# EasyEDA Pro project ProProject_Stc32f_Car副本_2024-06-03.epro, schematic schematic6

## Sheets
1 Motor_Driver: Create Date: 2024-05-04; Page Name: Motor_Driver; Project Name: Stc32f_Car; Schematic Name: Schematic6; Update Date: 2024-05-11; Company: 嘉立创EDA; Page Size: A4; Version: V1.0
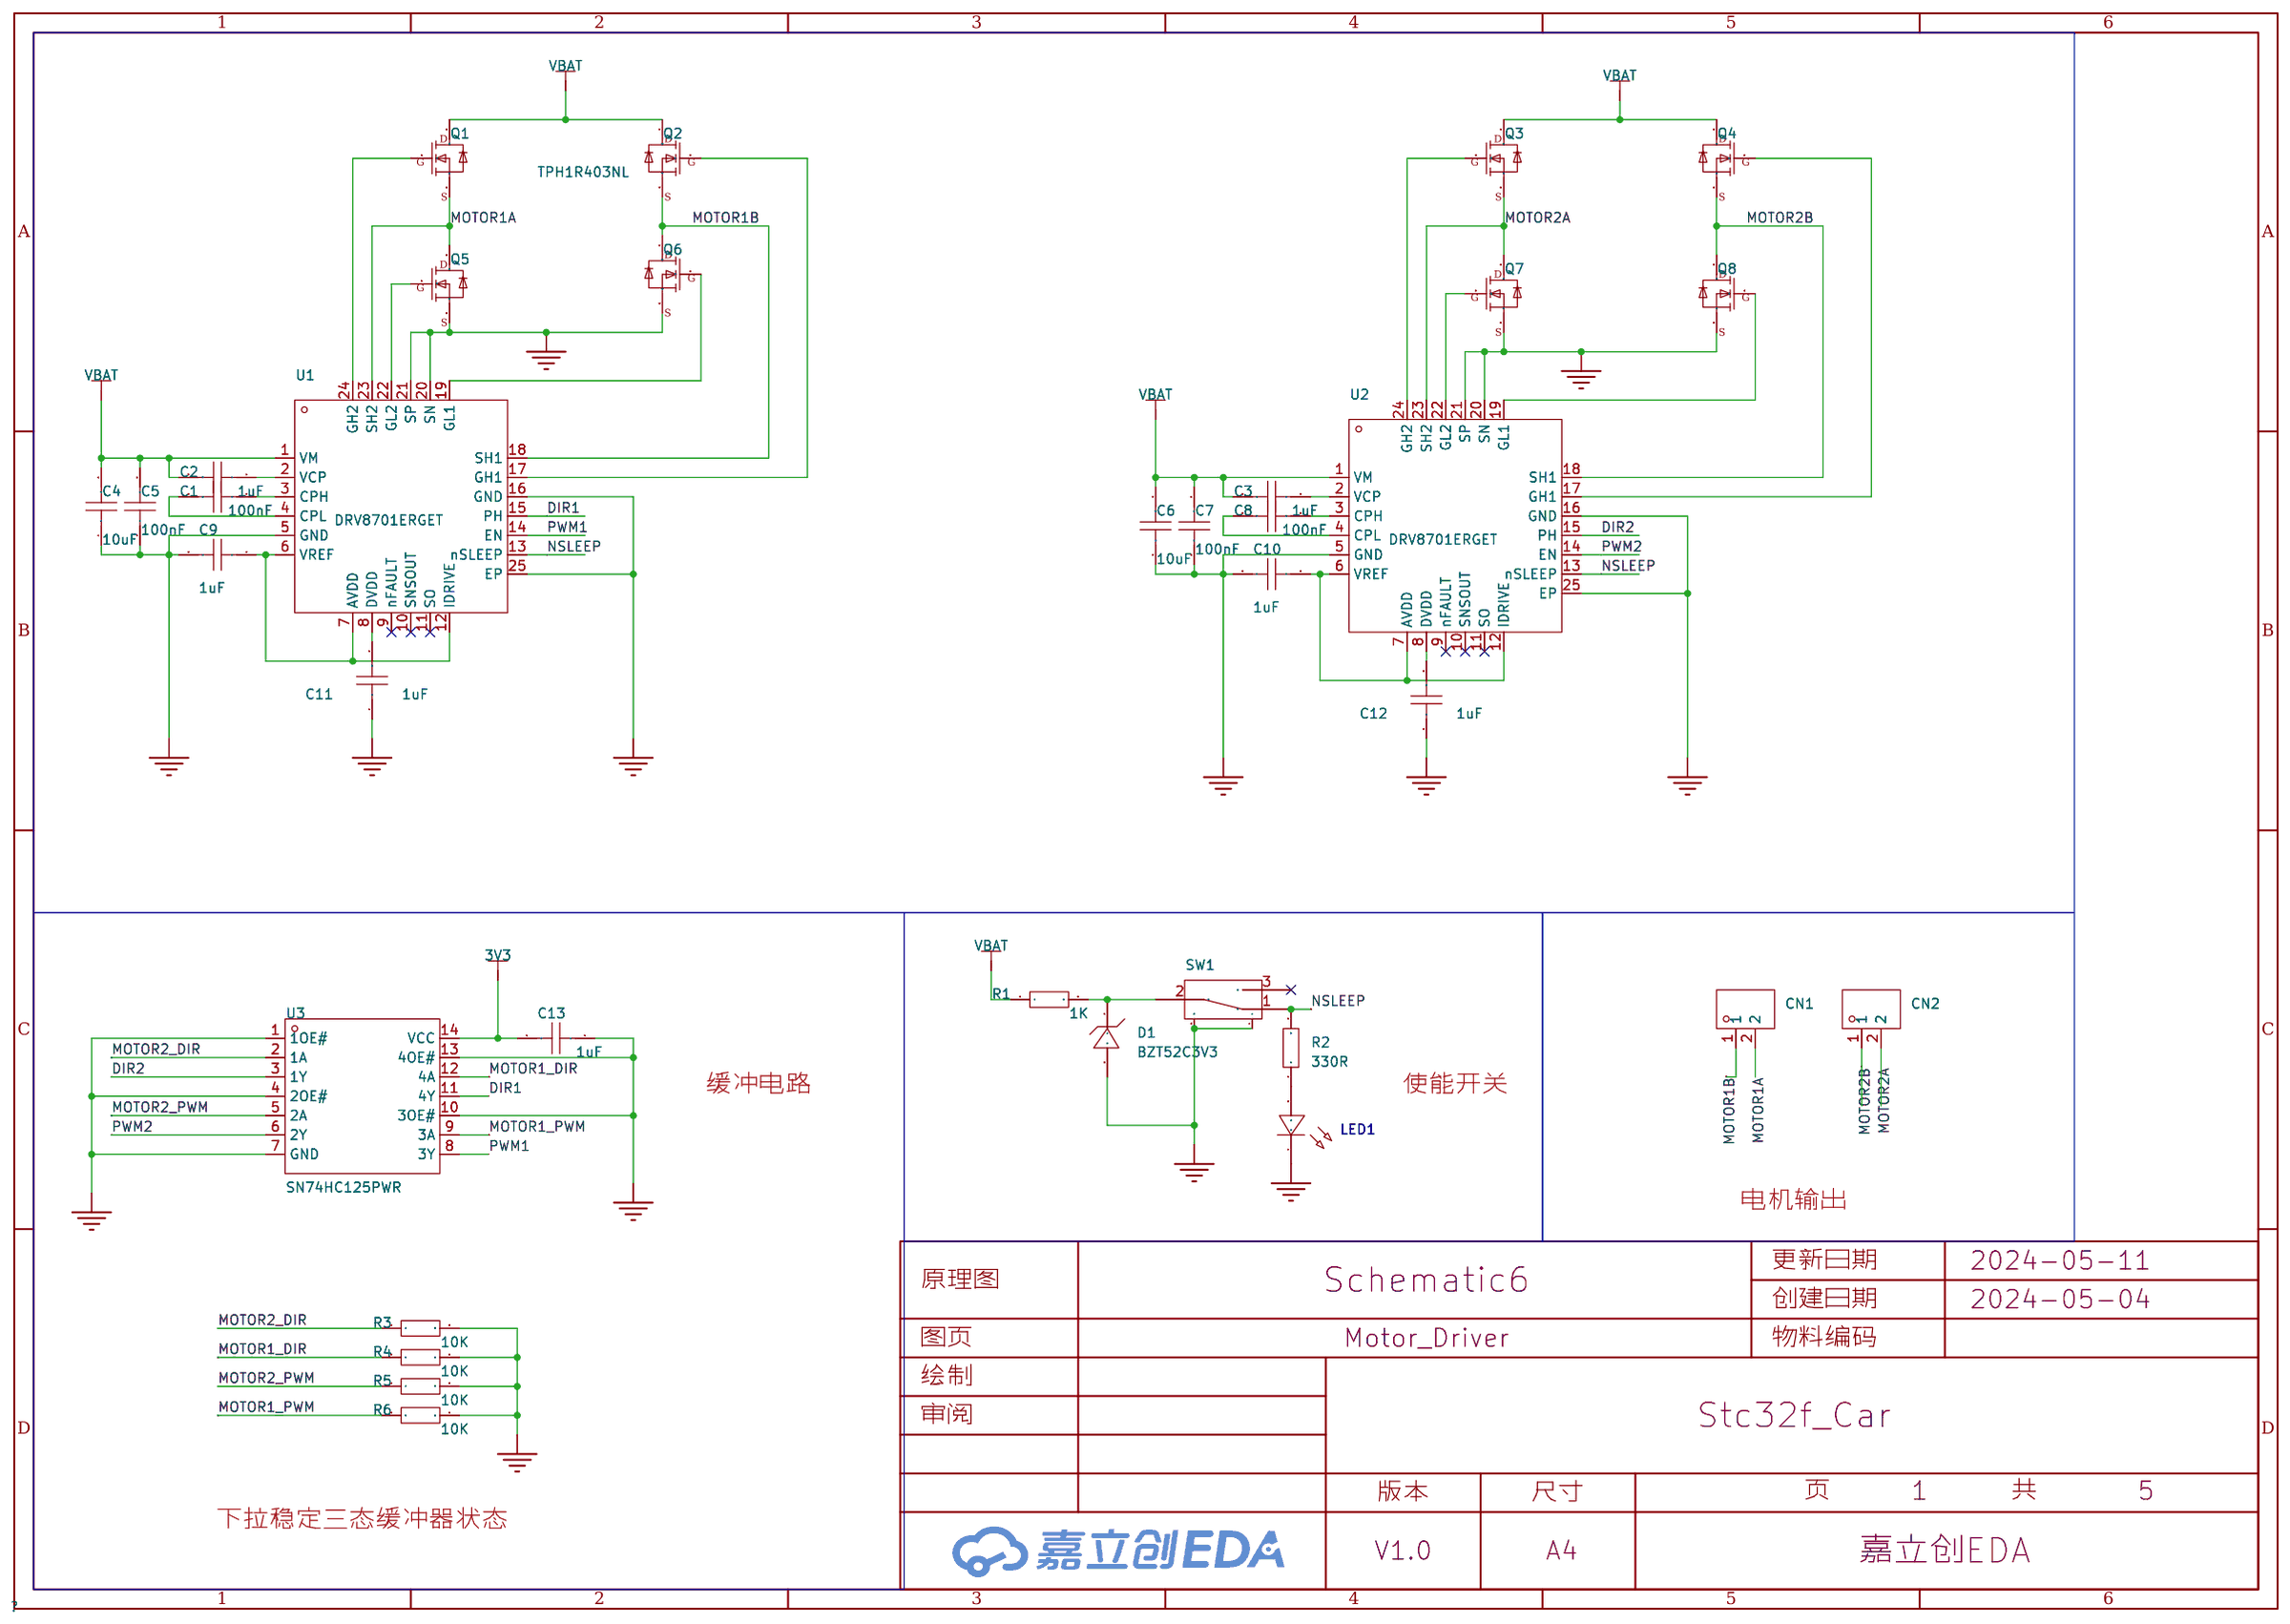
[diagram p4: Motor_Driver]
2 DCDC&amp;LDO: Page Name: DCDC&amp;LDO; Update Date: 2024-05-13
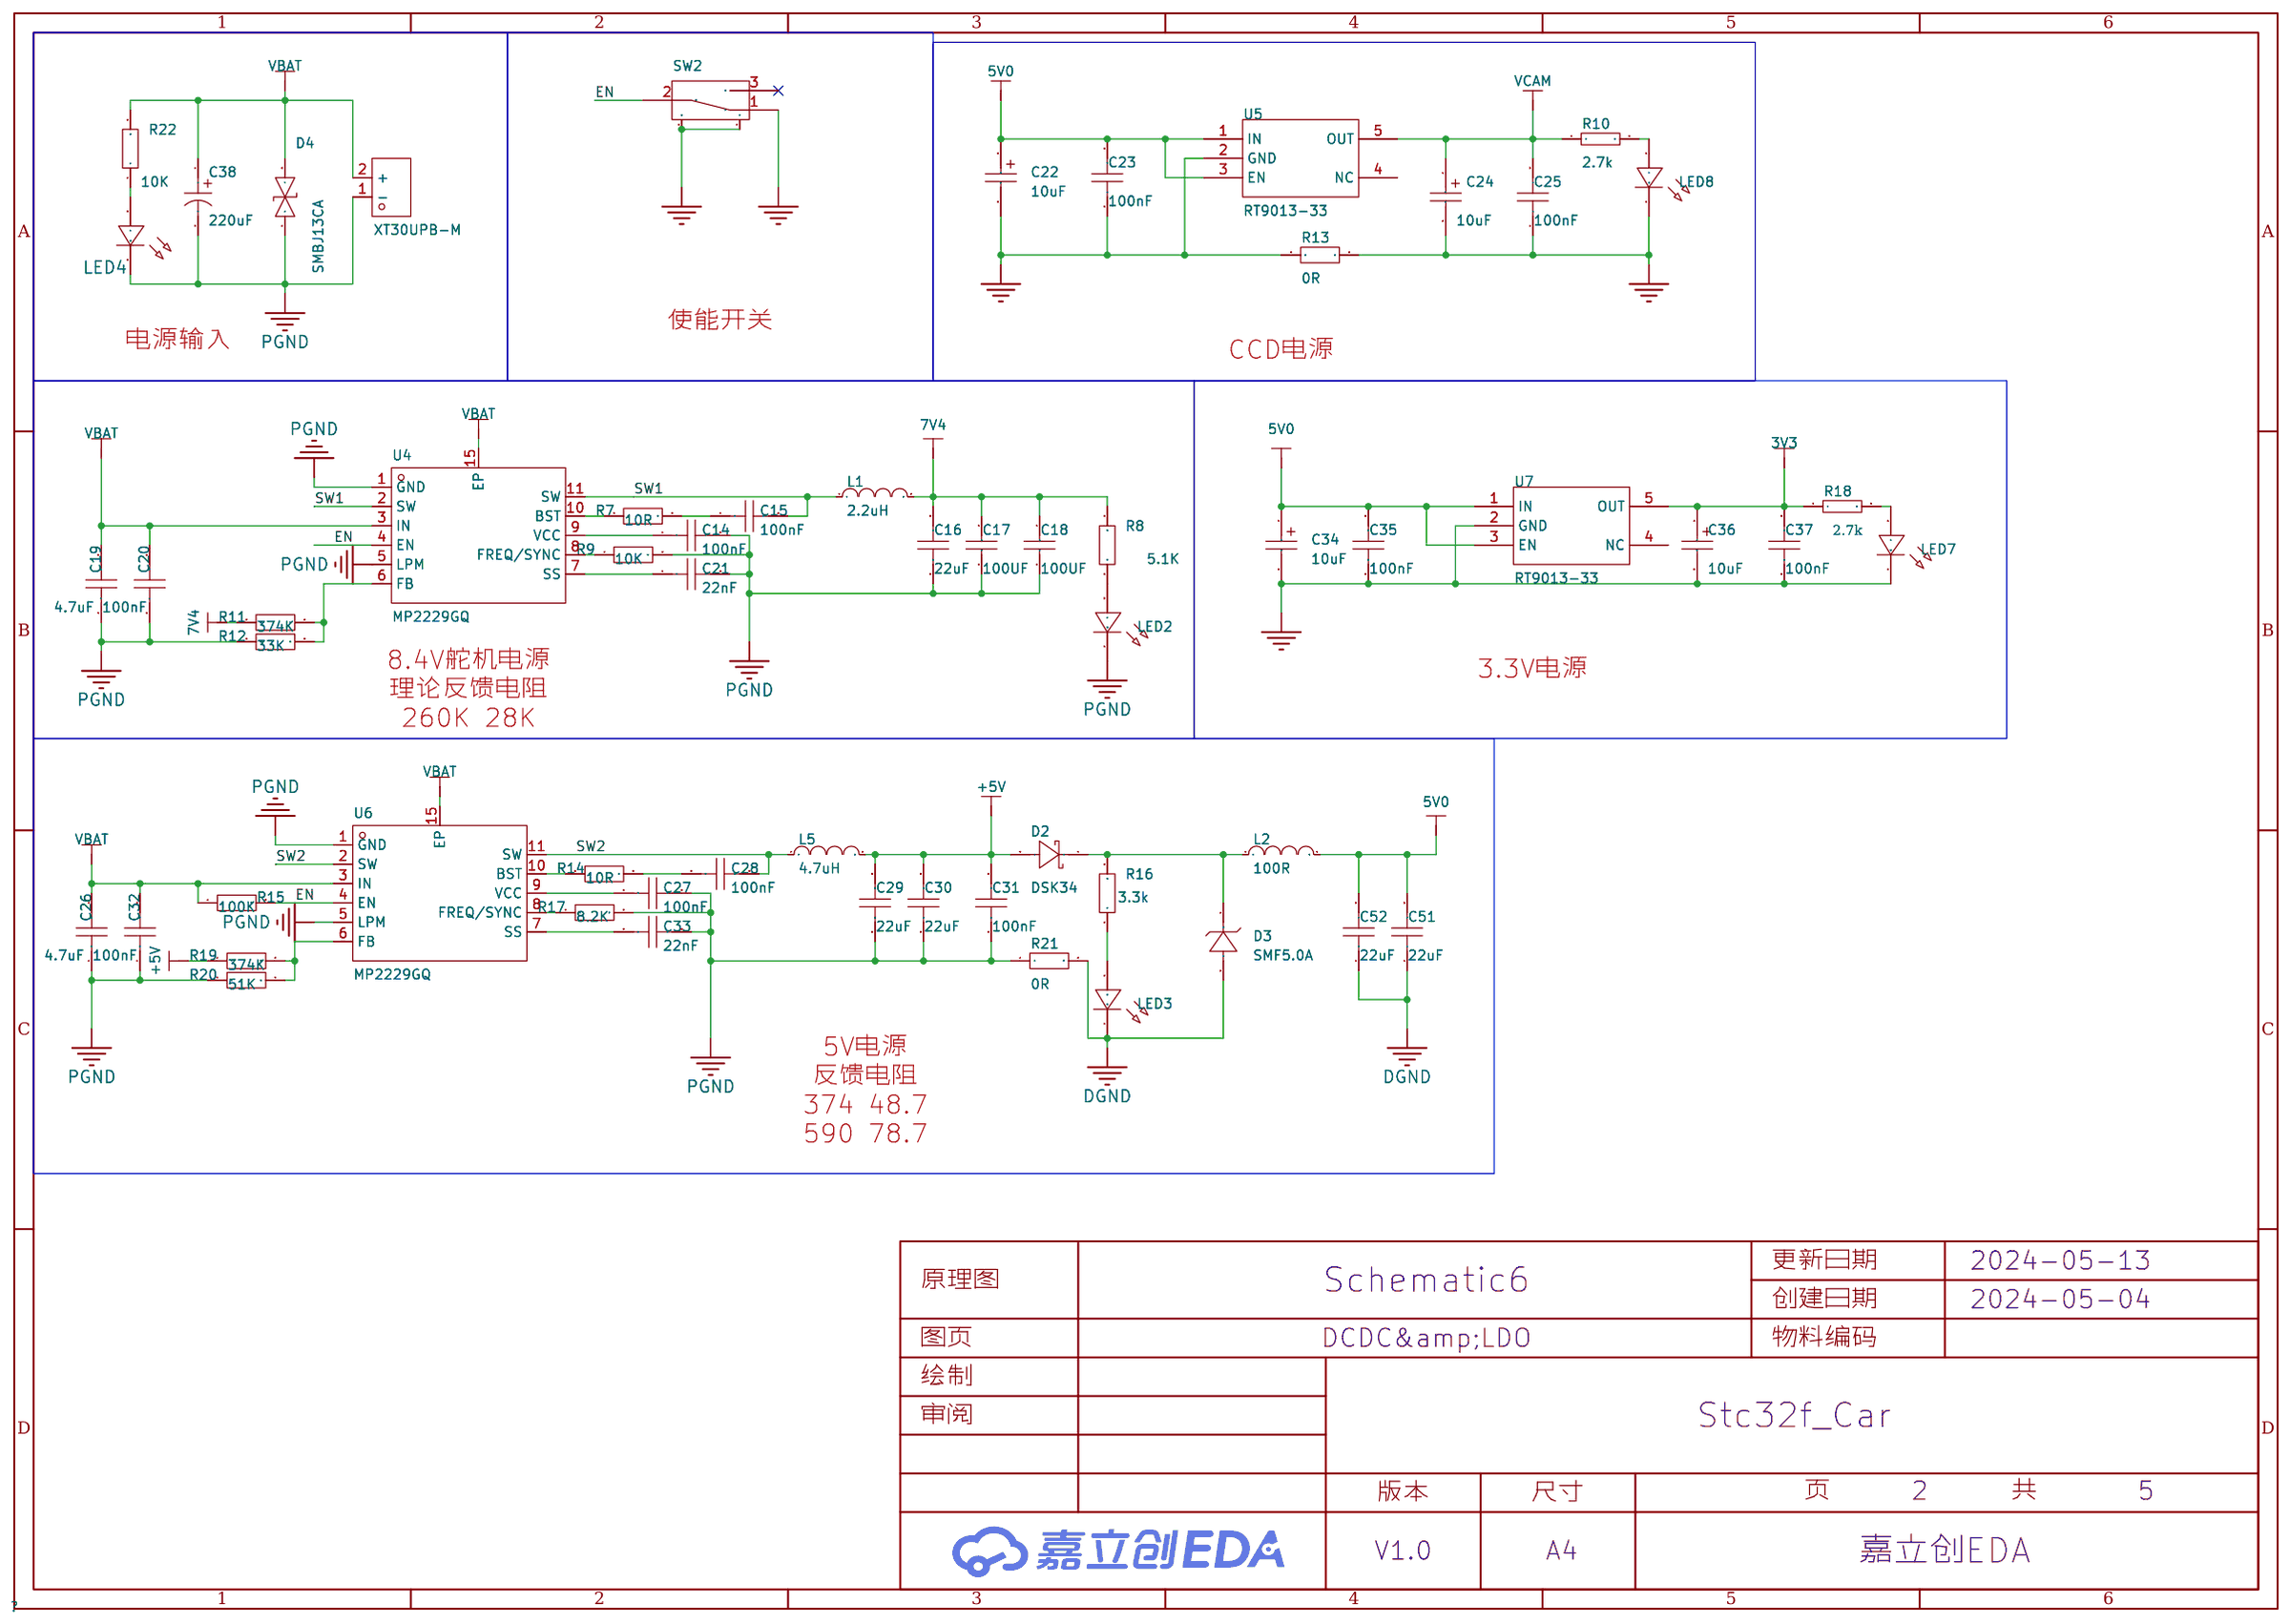
[diagram p5: DCDC&amp;LDO]
3 STC32F_Core: Page Name: STC32F_Core; Update Date: 2024-05-09
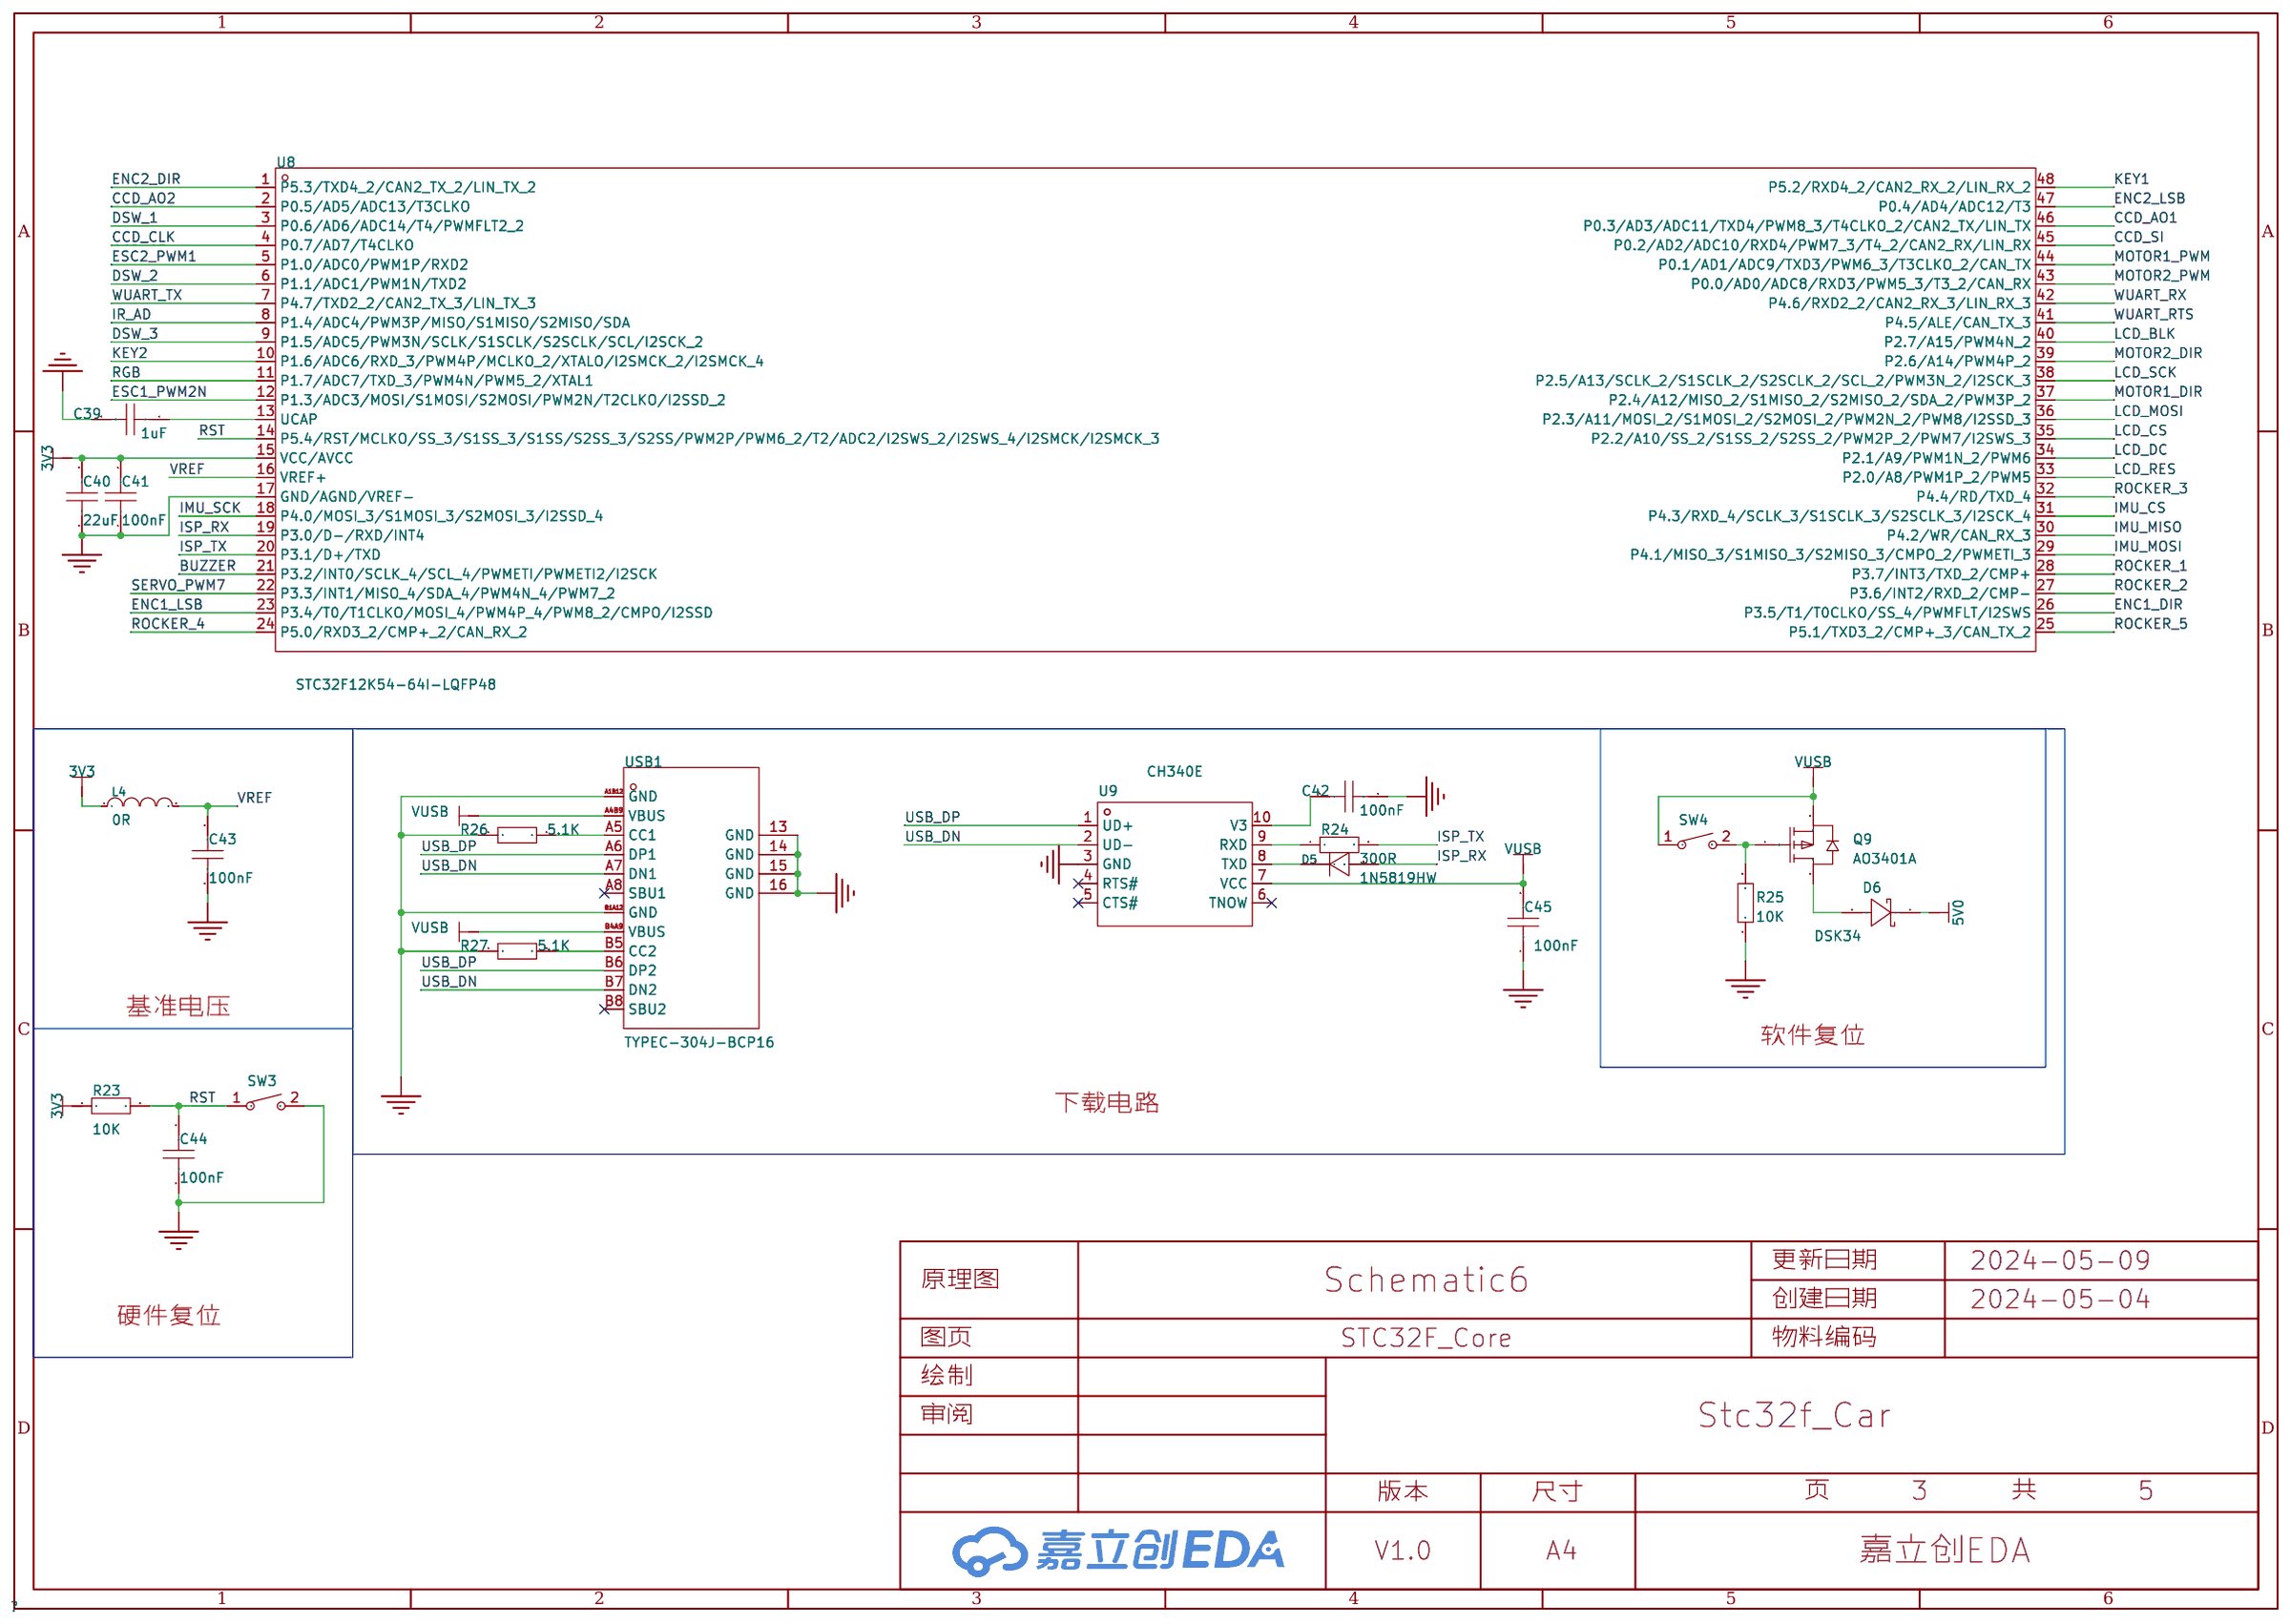
[diagram p6: STC32F_Core]
4 Conn_Port: Page Name: Conn_Port
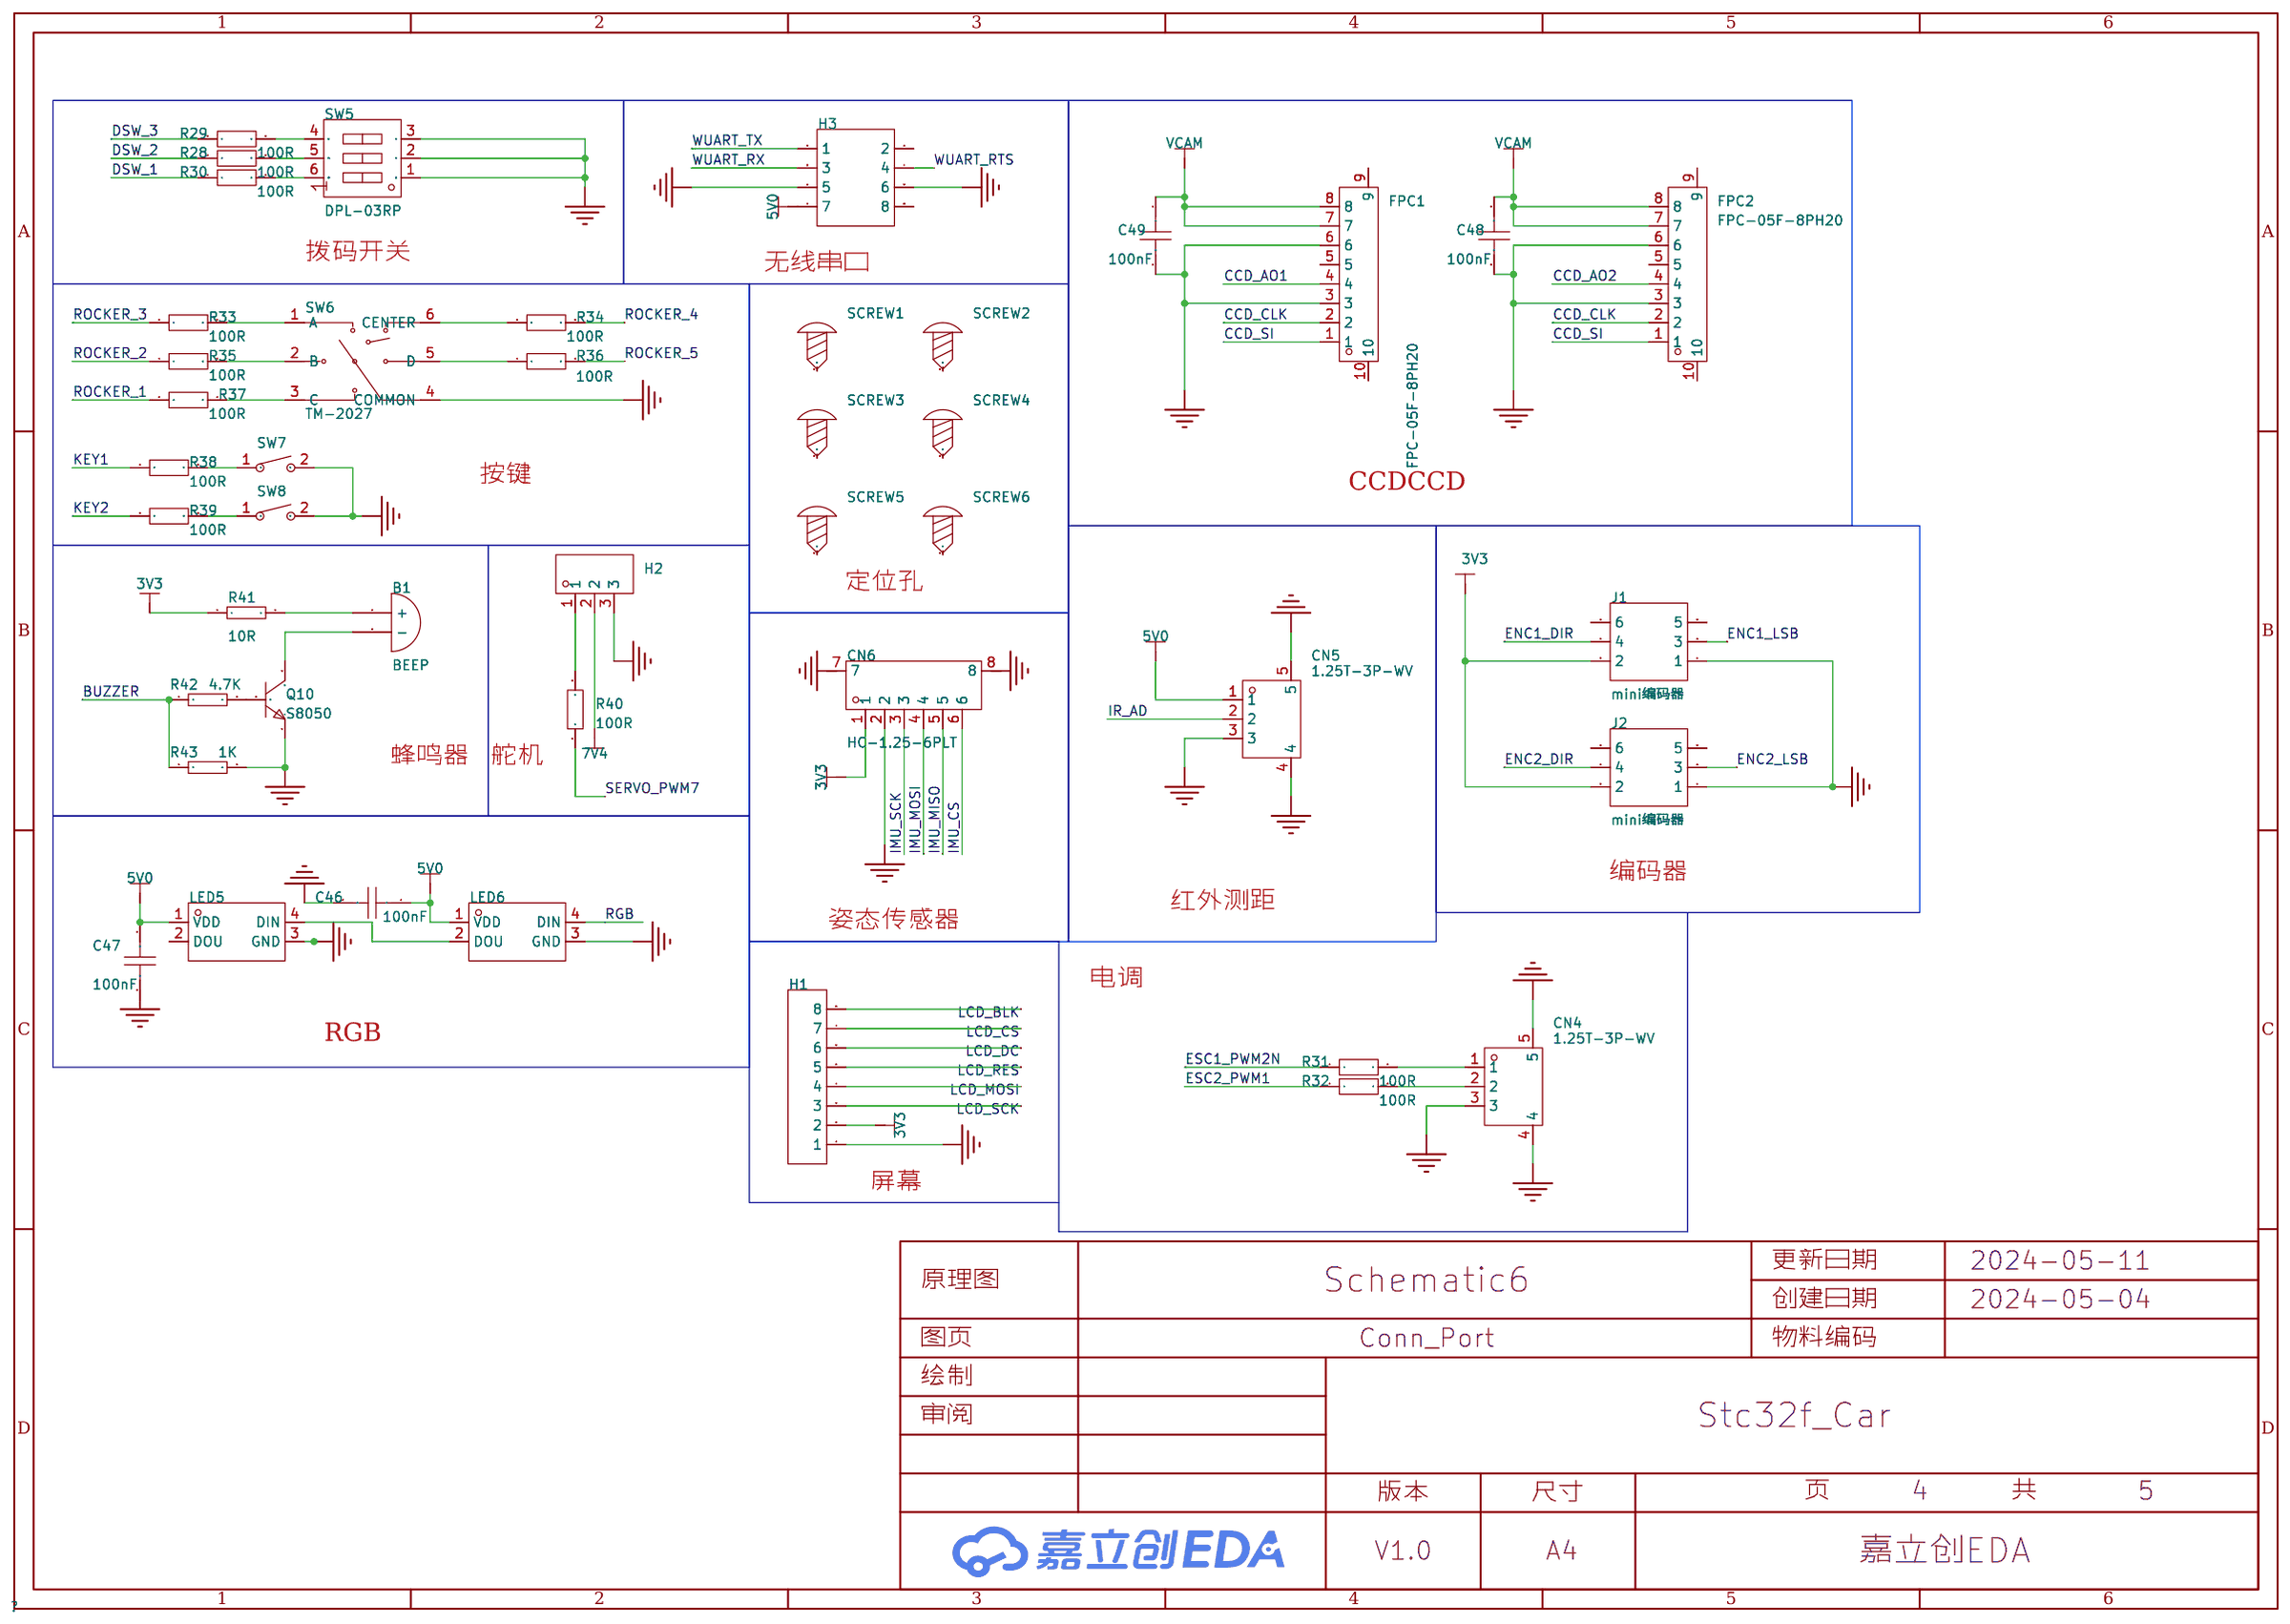
[diagram p7: Conn_Port]
5 引脚: Create Date: 2024-05-11; Page Name: 引脚
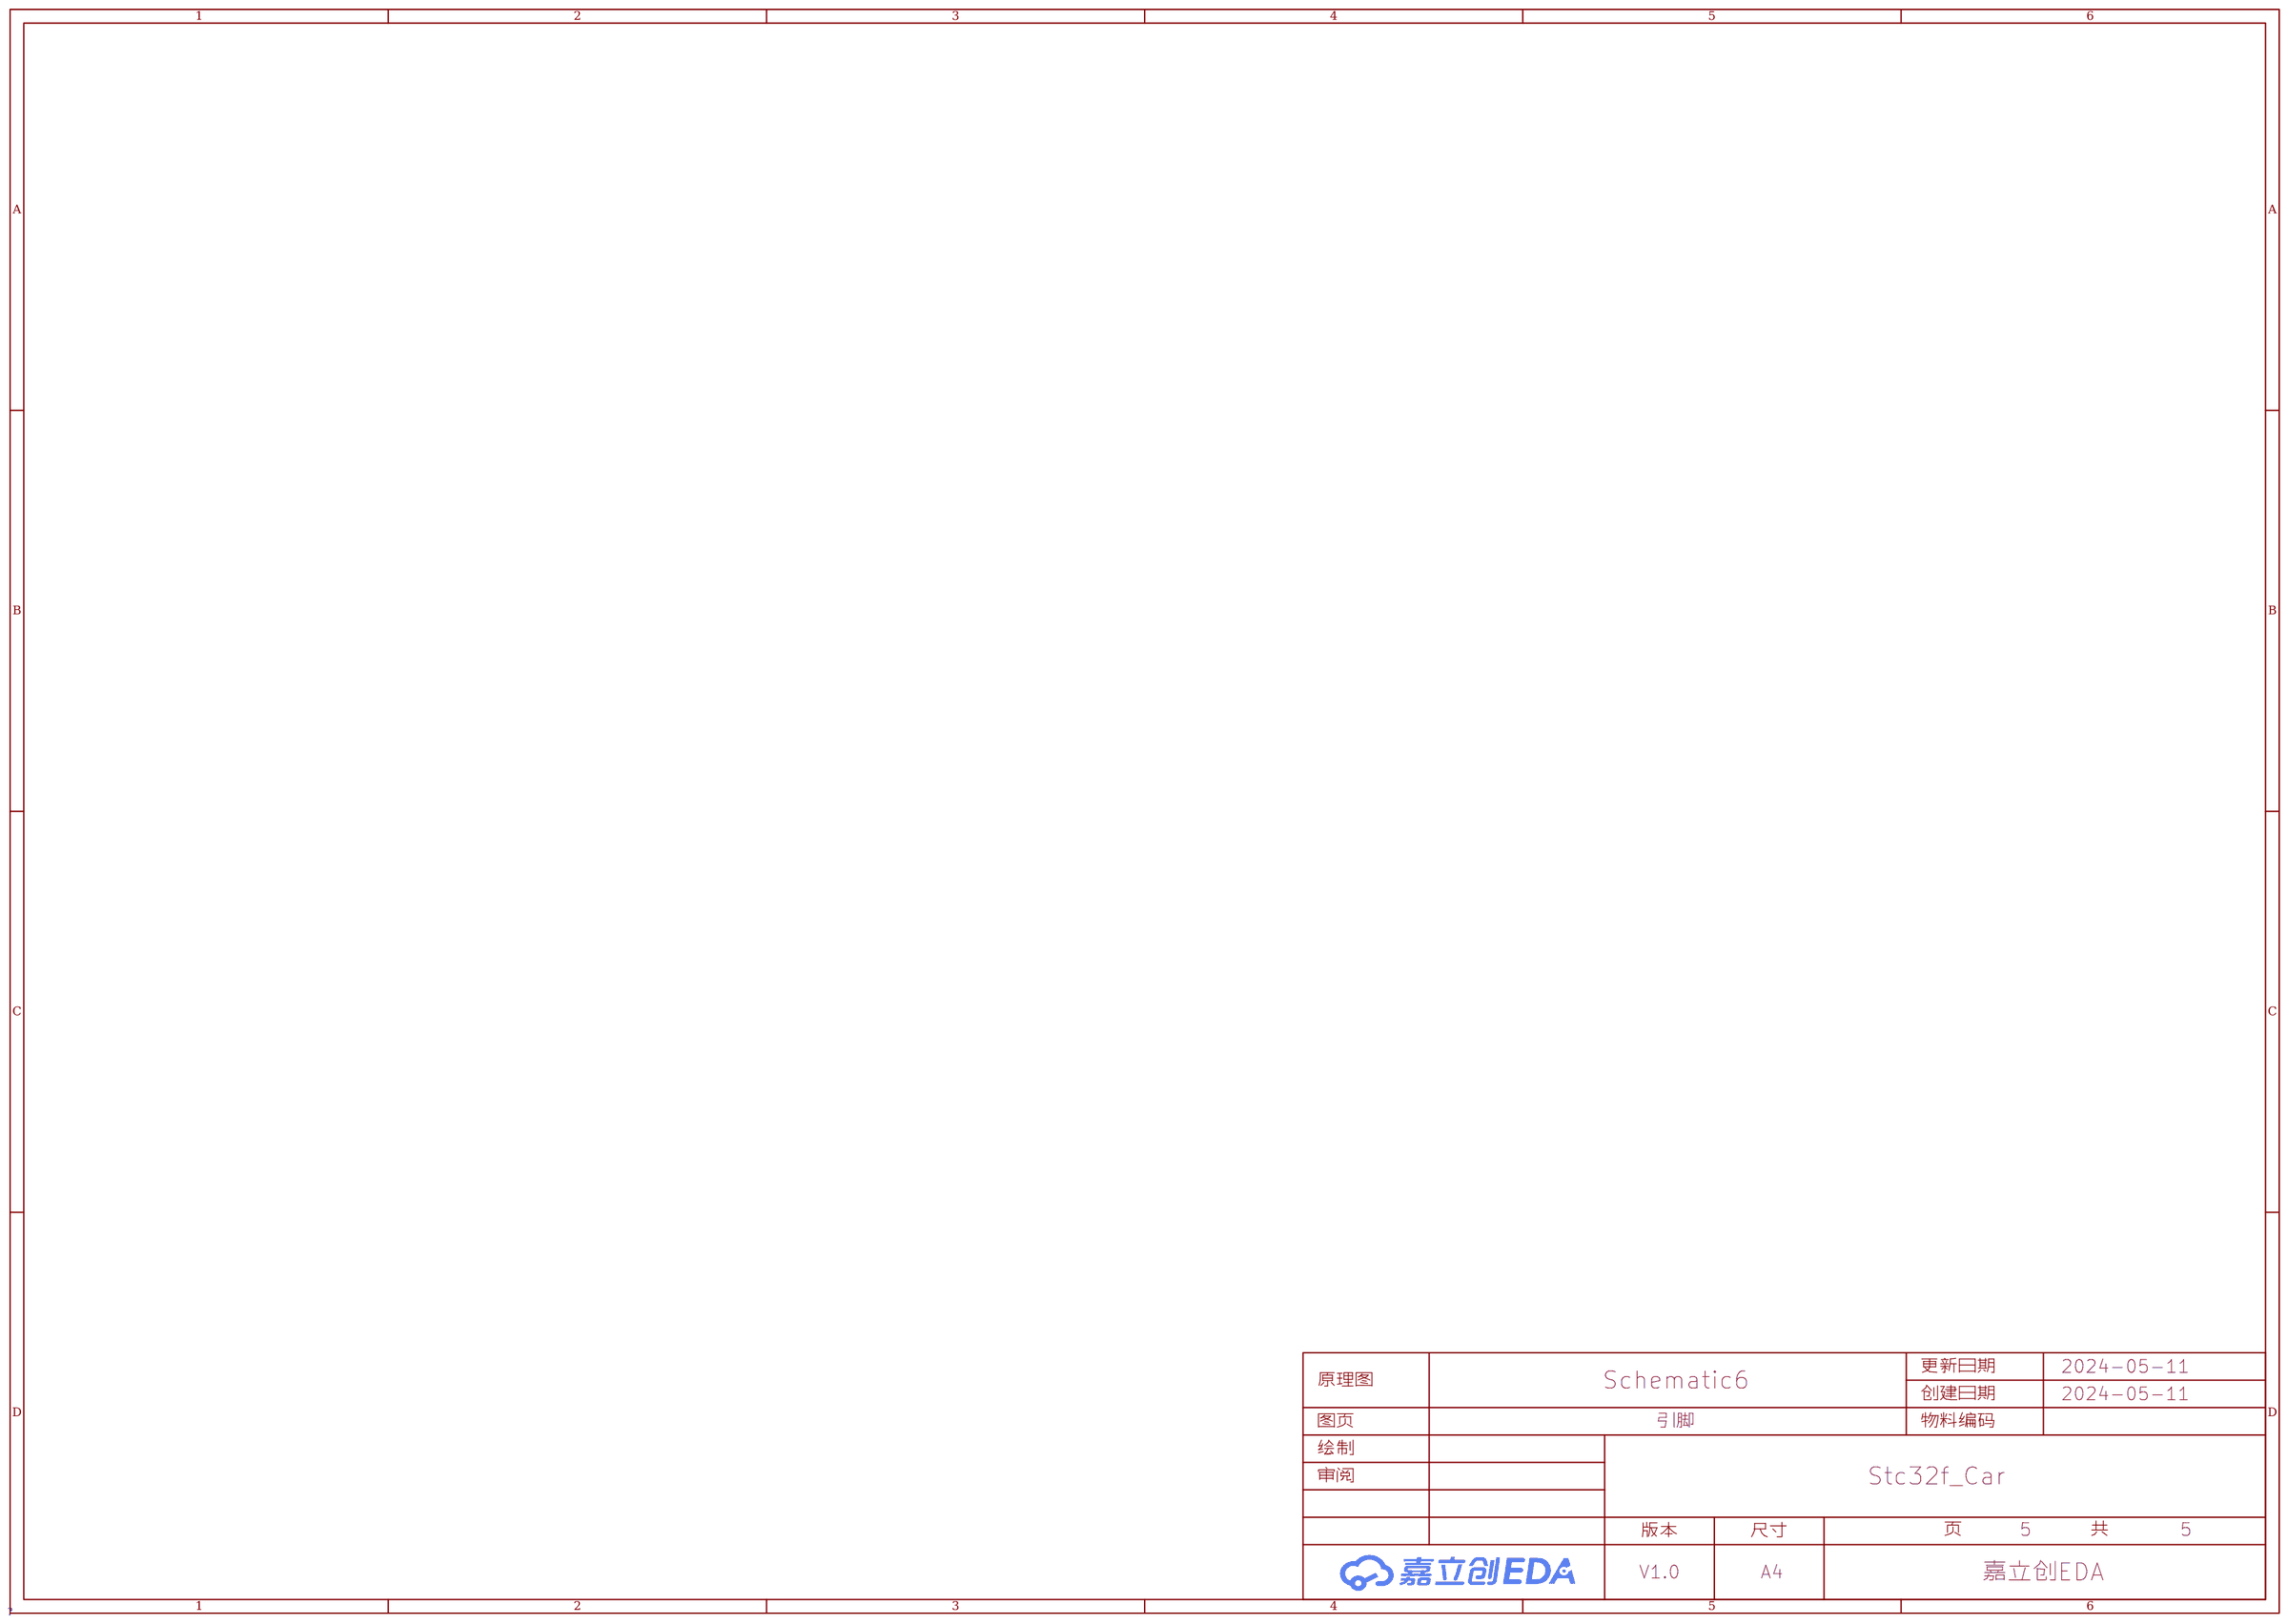
[diagram p8: 引脚]

## Parts
sheet Conn_Port
B1  BEEP  [BEEP 9x5.5mm]
C46  100nF  [C0603]
C47  100nF  [C0603]
C48  100nF  [C0603]
C49  100nF  [C0603]
CN4  1.25T-3P-WV  [CONN-SMD_1.25T-3P-WV]
CN5  1.25T-3P-WV  [CONN-SMD_1.25T-3P-WV]
CN6  HC-1.25-6PLT  [CONN-SMD_6P-P1.25_HC-1.25-6PLT]
FPC1  FPC-05F-8PH20  [FPC-SMD_8P-P0.50_FPC-05F-8PH20]
FPC2  FPC-05F-8PH20  [FPC-SMD_8P-P0.50_FPC-05F-8PH20]
H1  -  [HDR-TH_8P-P2.54-V-F-1]
H2  -  [HDR-TH_3P-P2.54-V-M]
H3  -  [HDR-TH_8P-P2.54-V-F-R2-C4-S2.54-1]
J1  mini编码器  [编码器牛角座_2x3_2.54]
J2  mini编码器  [编码器牛角座_2x3_2.54]
LED5  XL-5050RGBC-WS2812B  [LED-SMD_4P-L5.0-W5.0-BL_XL-5050RGBC]
LED6  XL-5050RGBC-WS2812B  [LED-SMD_4P-L5.0-W5.0-BL_XL-5050RGBC]
Q10  S8050  [SOT-23]
R28  100R  [R0603]
R29  100R  [R0603]
R30  100R  [R0603]
R31  100R  [R0603]
R32  100R  [R0603]
R33  100R  [R0603]
R34  100R  [R0603]
R35  100R  [R0603]
R36  100R  [R0603]
R37  100R  [R0603]
R38  100R  [R0603]
R39  100R  [R0603]
R40  100R  [R0603]
R41  10R  [R0603]
R42  4.7K  [R0603]
R43  1K  [R0603]
SCREW1  -  [M3螺丝]
SCREW2  -  [M3螺丝]
SCREW3  -  [M3螺丝]
SCREW4  -  [M3螺丝]
SCREW5  -  [M3螺丝]
SCREW6  -  [M3螺丝]
SW5  DPL-03RP  [SW-TH_6P-L9.2-W9.9-P2.54-LS7.6_1]
SW6  TM-2027  [SW-SMD_6P-P2.80-L10.2-W10.2]
SW7  TS-1071AD-A1B3-D4  [SW-SMD_L4.0-W3.0-LS4.8]
SW8  TS-1071AD-A1B3-D4  [SW-SMD_L4.0-W3.0-LS4.8]
sheet DCDC&amp;LDO
C14  100nF  [C0603]
C15  100nF  [C0603]
C16  22uF  [C0805]
C17  100UF  [CAP_1210]
C18  100UF  [CAP_1210]
C19  4.7uF  [CAP_1206]
C20  100nF  [C0603]
C21  22nF  [C0603]
C22  10uF  [CAP-T-S 3216]
C23  100nF  [C0603]
C24  10uF  [CAP-T-S 3216]
C25  100nF  [C0603]
C26  4.7uF  [CAP_1206]
C27  100nF  [C0603]
C28  100nF  [C0603]
C29  22uF  [C0805]
C30  22uF  [C0805]
C31  100nF  [C0603]
C32  100nF  [C0603]
C33  22nF  [C0603]
C34  10uF  [CAP-T-S 3216]
C35  100nF  [C0603]
C36  10uF  [CAP-T-S 3216]
C37  100nF  [C0603]
C38  220uF  [CAP-TH_BD6.3-P2.50-D0.6-FD-1]
C51  22uF  [C0805]
C52  22uF  [C0805]
CN3  XT30UPB-M  [CONN-TH_XT30UPB-M]
D2  DSK34  [SOD-123_L2.8-W1.8-LS3.7-RD]
D3  SMF5.0A  [SOD-123FL_L2.7-W1.8-LS3.8-RD]
D4  SMBJ13CA  [SMB_L4.6-W3.6-LS5.3-BI]
L1  2.2uH  [IND-SMD_L5.4-W5.2_FXL0530]
L2  100R  [L1206]
L5  4.7uH  [IND-SMD_L5.4-W5.2_FXL0530]
LED2  -  [LED_0603]
LED3  -  [LED_0603]
LED4  -  [LED_0603]
LED7  -  [LED_0603]
LED8  -  [LED_0603]
R7  10R  [R0603]
R8  10K  [R0603]
R9  10K  [R0603]
R10  2.7K  [R0603]
R11  374K  [R0603]
R12  33K  [R0603]
R13  0R  [R0805]
R14  10R  [R0603]
R15  100K  [R0603]
R16  10K  [R0603]
R17  8.2K  [R0603]
R18  2.7K  [R0603]
R19  374K  [R0603]
R20  51K  [R0603]
R21  0R  [R0805]
R22  10K  [R0603]
SW2  -  [拨动开关_侧]
U4  MP2229GQ  [QFN-14_L3.0-W3.0-P0.50-TL-EP]
U5  RT9013-33  [SOT-23-5]
U6  MP2229GQ  [QFN-14_L3.0-W3.0-P0.50-TL-EP]
U7  RT9013-33  [SOT-23-5]
sheet Motor_Driver
C1  100nF  [C0603]
C2  1uF  [C0603]
C3  1uF  [C0603]
C4  10uF  [C0805]
C5  100nF  [C0603]
C6  10uF  [C0805]
C7  100nF  [C0603]
C8  100nF  [C0603]
C9  1uF  [C0603]
C10  1uF  [C0603]
C11  1uF  [C0603]
C12  1uF  [C0603]
C13  1uF  [C0603]
CN1  XT30U-M  [CONN-TH_XT30U-M]
CN2  XT30U-M  [CONN-TH_XT30U-M]
D1  BZT52C3V3  [SOD-123_L2.7-W1.6-LS3.7-RD]
LED1  -  [LED_0603]
Q1  TPH1R403NL  [DFN5x6]
Q2  TPH1R403NL  [DFN5x6]
Q3  TPH1R403NL  [DFN5x6]
Q4  TPH1R403NL  [DFN5x6]
Q5  TPH1R403NL  [DFN5x6]
Q6  TPH1R403NL  [DFN5x6]
Q7  TPH1R403NL  [DFN5x6]
Q8  TPH1R403NL  [DFN5x6]
R1  1K  [R0603]
R2  330R  [R0603]
R3  10K  [R0603]
R4  10K  [R0603]
R5  10K  [R0603]
R6  10K  [R0603]
SW1  -  [拨动开关_侧]
U1  DRV8701ERGET  [VQFN-24_L4.0-W4.0-P0.50-BL-EP2.5]
U2  DRV8701ERGET  [VQFN-24_L4.0-W4.0-P0.50-BL-EP2.5]
U3  SN74HC125PWR  [TSSOP-14_L5.0-W4.4-P0.65-LS6.5-BL]
sheet STC32F_Core
C39  1uF  [C0603]
C40  22uF  [C0603]
C41  100nF  [C0603]
C42  100nF  [C0603]
C43  100nF  [C0603]
C44  100nF  [C0603]
C45  100nF  [C0603]
D5  1N5819HW  [SOD-123_L2.8-W1.8-LS3.7-RD-1]
D6  DSK34  [SOD-123FL_L2.7-W1.8-LS3.8-RD]
L4  0R  [L0603]
Q9  AO3401A  [SOT-23_L2.9-W1.3-P1.90-LS2.4-BR]
R23  10K  [R0603]
R24  300R  [R0603]
R25  10K  [R0603]
R26  5.1K  [R0603]
R27  5.1K  [R0603]
SW3  TS-1071AD-A1B3-D4  [SW-SMD_L4.0-W3.0-LS4.8]
SW4  TS-1071AD-A1B3-D4  [SW-SMD_L4.0-W3.0-LS4.8]
U8  STC32F12K54-64I-LQFP48  [LQFP-48_L7.0-W7.0-P0.50-LS9.0-BL]
U9  CH340E  [MSOP-10_L3.0-W3.0-P0.50-LS5.0-BL]
USB1  TYPEC-304J-BCP16  [USB-C-SMD_TYPEC-304J-BCP16]

## Library data of the parts
B1 = BEEP: Origin Footprint 2: BEEP 12x9.5mm
C1 C5 C7 C8 C14 C15 C20 C21 C23 C25 C27 C28 C31-C33 C35 C37 C39-C49 = CAP_0603: Supplier Footprint: 0603
CN4 CN5 = 1.25T-3P-WV: 插针结构:1x3P;间距:1.25mm;安装方式:立贴;参考系列:-;总PIN数:3P;排数:1;每排PIN数:3;行距:-;额定电流:1A;工作温度范围:-25℃~+85℃;; LCSC Part Name: 1x3P 间距:1.25mm 立贴; Supplier Part: C707314; Manufacturer: 韩国韩荣; Supplier Footprint: SMD,P=1.25mm; JLCPCB Part Class: 扩展库; Datasheet: https://atta.szlcsc.com/upload/public/pdf/source/20200721/C707314_9D6C5B771C6B51C71A6F5FC082C82874.pdf; Supplier: LCSC; Pins Structure: 1x3P; Pitch: 1.25mm; Mounting Style: 立贴; Number of Pins: 3P; Number of Rows: 1; Number of PINs Per Row: 3; Current Rating (Max): 1A; Operating Temperature Range: -25℃~+85℃
CN6 = HC-1.25-6PLT: 插针结构:1x6P;间距:1.25mm;安装方式:立贴;参考系列:-;总PIN数:6P;排数:1;每排PIN数:6;行距:-;额定电流:2A;触头材质:黄铜;触头镀层:锡;工作温度范围:-25℃~+85℃;; LCSC Part Name: 1x6P 间距:1.25mm 立贴; Supplier Part: C2845392; Manufacturer: HCTL(华灿天禄); Supplier Footprint: SMD,P=1.25mm; JLCPCB Part Class: 扩展库; Datasheet: https://atta.szlcsc.com/upload/public/pdf/source/20230707/8E5913B5A3195C18F5EE12EA4CB86B82.pdf; Supplier: LCSC; Pins Structure: 1x6P; Pitch: 1.25mm; Mounting Style: 立贴; Number of Pins: 6P; Number of Rows: 1; Number of PINs Per Row: 6; Current Rating (Max): 2A; Contact Material: 黄铜; Contact Plating: 锡; Operating Temperature Range: -25℃~+85℃
FPC1 FPC2 = FPC-05F-8PH20: 锁定特性:翻盖式;触点类型:下接;触点数量:8P;间距:0.5mm;安装类型:卧贴;工作温度范围:-25℃~+85℃;; LCSC Part Name: 间距:0.5mm P数:8P 翻盖式 下接; Supplier Part: C2856797; Manufacturer: XUNPU(讯普); Supplier Footprint: SMD,P=0.5mm,卧贴; JLCPCB Part Class: 扩展库; Datasheet: https://atta.szlcsc.com/upload/public/pdf/source/20210728/C2856796_EA80EFD10E16055FE067E7763B90421F.pdf; Supplier: LCSC; Locking Feature: 翻盖式; Contact Type: 下接; Number of Contacts: 8P; Pitch: 0.5mm; Mounting Type: 卧贴; FFC, FCB Thickness: 0.3mm; Height Above Board: 2mm; Operating Temperature Range: -25℃~+85℃
H1 = HDR-F_2.54_1x8P: Supplier Part: C27438; Supplier Footprint: 插件
H2 = HDR-M_2.54_1x3P: Supplier Part: C2937625; Supplier Footprint: 插件
H3 = HDR-F_2.54_2x4: Supplier Part: C92271; Supplier Footprint: 插件
J1 J2 = mini编码器: Manufacturer: 龙邱; Supplier Part: C65114
LED5 LED6 = XL-5050RGBC-WS2812B: 5050七彩幻彩透明贴片LED灯珠 5050 幻彩透明四脚 ws2812B 内置驱动IC; Supplier Part: C2843785; Manufacturer: XINGLIGHT(成兴光); Supplier Footprint: SMD5050; JLCPCB Part Class: 扩展库; Datasheet: https://atta.szlcsc.com/upload/public/pdf/source/20240412/E1004CAA80592E31D08BFE019083806F.pdf; Supplier: LCSC
Q10 = NPN S8050: Published: 8-Jun-2000; Revision: July-2002: Re-released for DXP Platform.; Publisher: Altium Limited; Price(RMB): 0.000
R1-R9 R11 R12 R14-R17 R19 R20 R22-R40 = Res_0603: Supplier Footprint: 0603
R41 = Res-Chip_10: Revision: V1.0; Power: 1/8W; Tolerance: ±1%; Origin Footprint 2: RESC0603[0201]-L; Origin Footprint 3: RESC0603[0201]-M; Origin Footprint 4: RESC0603[0201]-N; Origin Footprint 5: RESC0603[0201]S-L; Origin Footprint 6: RESC0603[0201]S-M; Origin Footprint 7: RESC0603[0201]S-N; Origin Footprint 8: RESC1005[0402]-L; Origin Footprint 9: RESC1005[0402]S-M; Origin Footprint 10: RESC1005[0402]-M; Origin Footprint 11: RESC1005[0402]-N; Origin Footprint 12: RESC1005[0402]S-L; Origin Footprint 13: RESC1005[0402]S-N; Origin Footprint 14: RESC1608[0603]-L; Origin Footprint 15: RESC1608[0603]-M; Origin Footprint 16: RESC1608[0603]-N; Origin Footprint 17: RESC1608[0603]S-L; Origin Footprint 18: RESC1608[0603]S-M; Origin Footprint 19: RESC2012[0805]; Origin Footprint 20: RESC2012[0805]S-L; Origin Footprint 21: RESC2012[0805]S-M; Origin Footprint 22: RESC2012[0805]S-N; Origin Footprint 23: RESC3216[1206]; Origin Footprint 24: RESC3216[1206]S-L; Origin Footprint 25: RESC3216[1206]S-M; Origin Footprint 26: RESC3216[1206]S-N; Origin Footprint 27: RESC3225[1210]; Origin Footprint 28: RESC3225[1210]S; Origin Footprint 29: RESC5025[2010]; Origin Footprint 30: RESC5025[2010]S; Origin Footprint 31: RESC6332[2512]; Origin Footprint 32: RESC6332[2512]S
R42 = Res-Chip_3: Revision: V1.0; Power: 1/8W; Tolerance: ±1%; Origin Footprint 2: RESC0603[0201]-L; Origin Footprint 3: RESC0603[0201]-M; Origin Footprint 4: RESC0603[0201]-N; Origin Footprint 5: RESC0603[0201]S-L; Origin Footprint 6: RESC0603[0201]S-M; Origin Footprint 7: RESC0603[0201]S-N; Origin Footprint 8: RESC1005[0402]-L; Origin Footprint 9: RESC1005[0402]S-M; Origin Footprint 10: RESC1005[0402]-M; Origin Footprint 11: RESC1005[0402]-N; Origin Footprint 12: RESC1005[0402]S-L; Origin Footprint 13: RESC1005[0402]S-N; Origin Footprint 14: RESC1608[0603]-L; Origin Footprint 15: RESC1608[0603]-M; Origin Footprint 16: RESC1608[0603]-N; Origin Footprint 17: RESC1608[0603]S-L; Origin Footprint 18: RESC1608[0603]S-M; Origin Footprint 19: RESC2012[0805]; Origin Footprint 20: RESC2012[0805]S-L; Origin Footprint 21: RESC2012[0805]S-M; Origin Footprint 22: RESC2012[0805]S-N; Origin Footprint 23: RESC3216[1206]; Origin Footprint 24: RESC3216[1206]S-L; Origin Footprint 25: RESC3216[1206]S-M; Origin Footprint 26: RESC3216[1206]S-N; Origin Footprint 27: RESC3225[1210]; Origin Footprint 28: RESC3225[1210]S; Origin Footprint 29: RESC5025[2010]; Origin Footprint 30: RESC5025[2010]S; Origin Footprint 31: RESC6332[2512]; Origin Footprint 32: RESC6332[2512]S
R43 = Res-Chip_11: Revision: V1.0; Power: 1/8W; Tolerance: ±1%; Origin Footprint 2: RESC0603[0201]-L; Origin Footprint 3: RESC0603[0201]-M; Origin Footprint 4: RESC0603[0201]-N; Origin Footprint 5: RESC0603[0201]S-L; Origin Footprint 6: RESC0603[0201]S-M; Origin Footprint 7: RESC0603[0201]S-N; Origin Footprint 8: RESC1005[0402]-L; Origin Footprint 9: RESC1005[0402]S-M; Origin Footprint 10: RESC1005[0402]-M; Origin Footprint 11: RESC1005[0402]-N; Origin Footprint 12: RESC1005[0402]S-L; Origin Footprint 13: RESC1005[0402]S-N; Origin Footprint 14: RESC1608[0603]-L; Origin Footprint 15: RESC1608[0603]-M; Origin Footprint 16: RESC1608[0603]-N; Origin Footprint 17: RESC1608[0603]S-L; Origin Footprint 18: RESC1608[0603]S-M; Origin Footprint 19: RESC2012[0805]; Origin Footprint 20: RESC2012[0805]S-L; Origin Footprint 21: RESC2012[0805]S-M; Origin Footprint 22: RESC2012[0805]S-N; Origin Footprint 23: RESC3216[1206]; Origin Footprint 24: RESC3216[1206]S-L; Origin Footprint 25: RESC3216[1206]S-M; Origin Footprint 26: RESC3216[1206]S-N; Origin Footprint 27: RESC3225[1210]; Origin Footprint 28: RESC3225[1210]S; Origin Footprint 29: RESC5025[2010]; Origin Footprint 30: RESC5025[2010]S; Origin Footprint 31: RESC6332[2512]; Origin Footprint 32: RESC6332[2512]S
SCREW1-SCREW6 = M3螺丝: Supplier Footprint: 插件
SW5 = DPL-03RP: 类型:琴键;电路结构:单刀单掷;开关位数:3位;额定电流:25mA;额定电压:24V;使用寿命:3千次;颜色:红色;; LCSC Part Name: 间距2.54mm 琴键 3位拨码开关; Supplier Part: C319070; Manufacturer: XKB Connectivity(中国星坤); Supplier Footprint: 插件; JLCPCB Part Class: 扩展库; Datasheet: https://atta.szlcsc.com/upload/public/pdf/source/20211009/01DEE1ECABD722E01D26E80670303730.pdf; Supplier: LCSC; Type: 琴键; Circuit: 单刀单掷; Number of Positions: 3位; Pin Style: PC引脚; Lead Pitch: 2.54mm; Current Rating: 25mA; Voltage Rating: 24V; Operating Temperature: -20℃~+70℃; Operating Life: 3千次; Color: 红色
SW6 = TM-2027: 10*10多功能五向开关; LCSC Part Name: 10*10多功能五向开关; Supplier Part: C318948; Manufacturer: XKB Connectivity(中国星坤); Supplier Footprint: SMD-6P,10x10mm; JLCPCB Part Class: 扩展库; Datasheet: https://atta.szlcsc.com/upload/public/pdf/source/20211015/9A47D7046B5F70B5D407F93F21F2FBAF.pdf; Supplier: LCSC
SW3 SW4 SW7 SW8 = TS-1071AD-A1B3-D4: 电路结构:单刀单掷;按钮形状:圆形按钮;作用力:250gf;安装方式:-;开关长度:4mm;开关宽度:3mm;开关高度:2mm;带灯:-;机械寿命:-;; LCSC Part Name: 轻触开关4.0*3.0*2两脚贴片无柱小龟250gf; Supplier Part: C492878; Manufacturer: Yuandi(元迪); JLCPCB Part Class: 扩展库; Datasheet: https://atta.szlcsc.com/upload/public/pdf/source/20200316/C492878_F665FC46291D1CEBBF5F4DDB4422506A.pdf; Supplier: LCSC; Circuit: 单刀单掷; Actuator Style: 圆形按钮; Operating Force: 250gf; Switch Length: 4mm; Switch Width: 3mm; Switch Height: 2mm
C4 C6 C16 C29 C30 C51 C52 = CAP_0805: Supplier Footprint: 0805
C17 C18 = 50V100UF-1210: Supplier Part: C9900003613; Supplier Footprint: C1210; JLCPCB Part Class: ExtendedPart; Datasheet: https://atta.szlcsc.comnull; Supplier: LCSC
C19 C26 = CAP_1206: Supplier Footprint: 1206
C22 C24 C34 C36 = T-S 10uF 3216 16V: Revision: July-2002: Re-released for DXP Platform.; Type: TanCap; Voltage: 16V
C38 = KNE2220UF25V149EC0030: 容值:220uF;精度:±20%;额定电压:25V;纹波电流:3.1A@100kHz;等效串联电阻:18mΩ@100kHz;; LCSC Part Name: 220uF ±20% 25V; Supplier Part: C2943986; Manufacturer: KNSCHA(科尼盛); Supplier Footprint: 插件,D6.3xL8mm; JLCPCB Part Class: 扩展库; Datasheet: https://atta.szlcsc.com/upload/public/pdf/source/20220426/6D36ABCEAFF08C1F9183CDC059524FCA.pdf; Supplier: LCSC; Tolerance: ±20%; Rated Voltage: 25V; Ripple Current: 3.1A@100kHz; Equivalent Series Resistance(ESR): 18mΩ@100kHz; Lead Spacing: 2.5mm; φD: 6.3mm; L: 8mm; Lifetime @ Temp: 2000hrs@105℃; Operating Temperature: -55℃~+105℃
CN3 = XT30UPB-M: 类别:-;类型1:-;; Supplier Part: C428721; Manufacturer: AMASS(艾迈斯); JLCPCB Part Class: ExtendedPart; Datasheet: https://atta.szlcsc.com/upload/public/pdf/source/20190916/C428721_B0ECB8C5937139CEFE8736D2D3175B0E.pdf; Supplier: LCSC; Brand: 艾迈斯; Type: 航模插头; Colour: 黄色; RatedVoltage: DC 500V; InterfaceType: 公头; MetalMaterial: 镀金; InsulationMaterial: PA; RatedCurrent: 15A; contact resistance: 0.65mΩ
D2 = DSK34: 二极管配置:-;直流反向耐压(Vr):40V;平均整流电流(Io):3A;正向压降(Vf):550mV@3A;反向电流(Ir):500A@40V;; LCSC Part Name: 40V3A550mV@3A; Supplier Part: C908230; Manufacturer: FUXINSEMI(富芯森美); Supplier Footprint: SOD-123; JLCPCB Part Class: ExtendedPart; Datasheet: https://atta.szlcsc.com/upload/public/pdf/source/20201027/C908230_5B73A4E0F076D2A690D7C134AB43D23C.pdf; Supplier: LCSC; Reverse Voltage (Vr): 40V; Average Rectified Current (Io): 3A; Forward Voltage (Vf@If): 550mV@3A; Reverse Leakage Current (Ir): 500A@40V
D3 = SMF5.0A_C908213: 反向截止电压(Vrwm):5V;最大钳位电压:9.2V;峰值脉冲电流(Ipp)@10/1000us:21.7A;击穿电压:6.4V;; Supplier Part: C908213; Manufacturer: FUXINSEMI(富芯森美); Supplier Footprint: SOD-123; JLCPCB Part Class: Extended Part; Datasheet: https://atta.szlcsc.com/upload/public/pdf/source/20201023/C908211_2B6F82B5D5E79B5CF282141215A9A141.pdf; Supplier: LCSC; Reverse Stand-Off Voltage (Vrwm): 5V; Maximum Clamping Voltage: 9.2V; Peak Pulse Current (Ipp)@10/1000us: 21.7A; Breakdown Voltage: 6.4V; Reverse Leakage Current (Ir): 800uA; Type: TVS
D4 = SMBJ18CA_C83327: 极性:Bidirectional;峰值脉冲电流（10/1000us）:20.6A;箝位电压:29.2V;击穿电压（最小值）:20V;反向关断电压（典型值）:18V;; LCSC Part Name: SMBJ18CA; Supplier Part: C83327; Manufacturer: Littelfuse(美国力特); Supplier Footprint: SMB(DO-214AA); JLCPCB Part Class: ExtendedPart; Datasheet: https://atta.szlcsc.com/upload/public/pdf/source/20181015/C83327_9F4F00736D8780122603CE2E8B594F64.pdf; Supplier: LCSC; Polarity: Bidirectional; Current - Peak Pulse (10/1000μs): 20.6A; Voltage - Clamping (Max) @ Ipp: 29.2V; Voltage - Breakdown (Min): 20V; Voltage - Reverse Standoff (Typ): 18V
L1 L5 = FXL0530-2R2-M: 电感值:2.2uH;精度:±20%;额定电流:7A;饱和电流(Isat):7.5A;类型:一体成型电感;; LCSC Part Name: 2.2uH ±20% 7.5A; Supplier Part: C177247; Manufacturer: cjiang(长江微电); Supplier Footprint: SMD,5.2x5.4mm; JLCPCB Part Class: 扩展库; Datasheet: https://atta.szlcsc.com/upload/public/pdf/source/20230516/4BF6F9C76E81720F52A39ED5FFFA18B4.pdf; Supplier: LCSC; Tolerance: ±20%; Rated Current: 7A; Saturation Current (Isat): 7.5A; DC Resistance (DCR): 29mΩ; Type: 一体成型电感
L2 = CBW321609U601T: 标称阻抗@测试频率:600Ω@100MHz;误差:±25%;直流电阻(RDC):250mΩ;; LCSC Part Name: 单路 1206磁珠 阻抗600Ω@100MHz; Supplier Part: C73732; Manufacturer: FH(风华); Supplier Footprint: 1206; JLCPCB Part Class: 扩展库; Datasheet: https://atta.szlcsc.com/upload/public/pdf/source/20190129/C361676_507080CDC8DBC2B0B7C2139C1873642D.pdf; Supplier: LCSC; Impedance @ Frequency: 600Ω@100MHz; Tolerance: ±25%; DC Resistance: 250mΩ; Current Rating: 2A; Circuits: 1
LED1-LED3 LED7 LED8 = LED_0603-B: Supplier Footprint: 0603
LED4 = LED_0603-R: Supplier Footprint: 0603
R10 R18 = Res-Chip_6: Revision: V1.0; Power: 1/8W; Tolerance: ±1%; Origin Footprint 2: RESC0603[0201]-L; Origin Footprint 3: RESC0603[0201]-M; Origin Footprint 4: RESC0603[0201]-N; Origin Footprint 5: RESC0603[0201]S-L; Origin Footprint 6: RESC0603[0201]S-M; Origin Footprint 7: RESC0603[0201]S-N; Origin Footprint 8: RESC1005[0402]-L; Origin Footprint 9: RESC1005[0402]S-M; Origin Footprint 10: RESC1005[0402]-M; Origin Footprint 11: RESC1005[0402]-N; Origin Footprint 12: RESC1005[0402]S-L; Origin Footprint 13: RESC1005[0402]S-N; Origin Footprint 14: RESC1608[0603]-L; Origin Footprint 15: RESC1608[0603]-M; Origin Footprint 16: RESC1608[0603]-N; Origin Footprint 17: RESC1608[0603]S-L; Origin Footprint 18: RESC1608[0603]S-M; Origin Footprint 19: RESC2012[0805]; Origin Footprint 20: RESC2012[0805]S-L; Origin Footprint 21: RESC2012[0805]S-M; Origin Footprint 22: RESC2012[0805]S-N; Origin Footprint 23: RESC3216[1206]; Origin Footprint 24: RESC3216[1206]S-L; Origin Footprint 25: RESC3216[1206]S-M; Origin Footprint 26: RESC3216[1206]S-N; Origin Footprint 27: RESC3225[1210]; Origin Footprint 28: RESC3225[1210]S; Origin Footprint 29: RESC5025[2010]; Origin Footprint 30: RESC5025[2010]S; Origin Footprint 31: RESC6332[2512]; Origin Footprint 32: RESC6332[2512]S
R13 R21 = Res_0805: Supplier Footprint: 0805
SW1 SW2 = 拨动开关_侧: Supplier Footprint: 插件
U4 U6 = MP2229GQ: Supplier Part: C2842154; Supplier Footprint: QFN-14; JLCPCB Part Class: ExtendedPart; Datasheet: https://atta.szlcsc.com/upload/public/pdf/source/20210630/C2842154_B7A2A20956B53227ED1EF1446B1FF4E8.pdf; Supplier: LCSC
U5 U7 = RT9013-33
C2 C3 C9-C13 = 0603B105K250NT: 容值:1uF;精度:±10%;额定电压:25V;材质(温度系数):X7R;; LCSC Part Name: 1uF ±10% 25V; Supplier Part: C59302; Manufacturer: FH(风华); Supplier Footprint: 0603; JLCPCB Part Class: Extended Part; Datasheet: https://atta.szlcsc.com/upload/public/pdf/source/20200305/C486355_26A10D38EF8C2A5C37091D0039909270.pdf; Supplier: LCSC; Tolerance: ±10%; Voltage Rated: 25V; Temperature Coefficient: X7R
CN1 CN2 = XT30U-M: 类别:-;类型1:-;; LCSC Part Name: AMASS(艾迈斯)轻量版锂电池插头公头 XT30U-M; Supplier Part: C99101; Manufacturer: AMASS(艾迈斯); JLCPCB Part Class: Extended Part; Datasheet: https://atta.szlcsc.com/upload/public/pdf/source/20170606/1496716542582.pdf; Supplier: LCSC; Brand: 艾迈斯; Type: 插头; Colour: 黄色; InterfaceType: 公头
D1 = BZT52C3V3_C173413: 二极管配置:独立式;稳压值(标称值):3.3V;稳压值(范围):3.1V~3.5V;功率:500mW;精度:-;; Supplier Part: C173413; Manufacturer: MDD; Supplier Footprint: SOD-123; JLCPCB Part Class: Extended Part; Datasheet: https://atta.szlcsc.com/upload/public/pdf/source/20230823/A46C7C97908205398E4407DE202CED03.pdf; Supplier: LCSC; Diode Configuration: 独立式; Zener Voltage (Nom): 3.3V; Reverse Leakage Current (Ir): 5uA@1V; Zener Voltage (Range): 3.1V~3.5V; Power Dissipation: 500mW; Zener Impedance (Zzt): 95Ω
Q1-Q8 = TPH1R403NL
U1 U2 = DRV8701ERGET: 驱动电机类型:有刷直流电机;电源电压:0V~5.5V;输出电流:-;接口:并行;; LCSC Part Name: 有刷直流电机驱动芯片 5.5V; Supplier Part: C132049; Manufacturer: TI(德州仪器); Supplier Footprint: VQFN-24(4x4); JLCPCB Part Class: 扩展库; Datasheet: https://www.ti.com/cn/lit/gpn/drv8701; Supplier: LCSC; Drive motor type: 有刷直流电机; Supply Voltage: 0V~5.5V; Interface: 并行; Operating Temperature: -40℃~+125℃@(Ta)
U3 = SN74HC125PWR: 输入类型:-;电源电压:2V~6V;元件数:4;每个元件位数:1;灌电流(IOL):7.8mA;拉电流(IOH):7.8mA;; Supplier Part: C132994; Manufacturer: TI(德州仪器); Supplier Footprint: TSSOP-14; JLCPCB Part Class: 扩展库; Datasheet: https://www.ti.com/cn/lit/gpn/sn74hc125; Supplier: LCSC; output type: 三态; Supply Voltage: 2V~6V; Number of Elements: 4; Number of Bits per Element: 1; Sink Current: 7.8mA; Source Current: 7.8mA; Logic Family: 74HC; Operating Temperature: -40℃~+85℃
D5 = 1N5819HWQ-7-F: 正向压降(Vf):750mV@3A;直流反向耐压(Vr):40V;平均整流电流(Io):1A;; LCSC Part Name: 电压:40V 电流:1A; Supplier Part: C460770; Manufacturer: DIODES(美台); Supplier Footprint: SOD-123; JLCPCB Part Class: 扩展库; Datasheet: https://atta.szlcsc.com/upload/public/pdf/source/20191127/C460770_590D249E8DF2091F3A1D6C2791B29A06.pdf; Supplier: LCSC; Forward Voltage (Vf@If): 750mV@3A; Reverse Voltage (Vr): 40V; Average Rectified Current (Io): 1A; Reverse Leakage Current (Ir): 1mA@40V
D6 = DSK34_C727076: 二极管配置:独立式;正向压降(Vf):520mV@3A;直流反向耐压(Vr):40V;平均整流电流(Io):3A;; LCSC Part Name: 电压:40V 电流:3A; Supplier Part: C727076; Manufacturer: TWGMC(台湾迪嘉); Supplier Footprint: SOD-123FL; JLCPCB Part Class: 扩展库; Datasheet: https://atta.szlcsc.com/upload/public/pdf/source/20200828/C727076_B37FCA1E25E95F22A97D5A5D18D72E25.pdf; Supplier: LCSC; Diode Configuration: 独立式; Forward Voltage (Vf@If): 520mV@3A; Reverse Voltage (Vr): 40V; Average Rectified Current (Io): 3A; Reverse Leakage Current (Ir): 500uA@40V
L4 = L_0603
Q9 = AO3401A_C15127: 类型:1个P沟道;漏源电压(Vdss):30V;连续漏极电流(Id):4A;功率(Pd):1.4W;导通电阻(RDS(on)@Vgs,Id):44mΩ@10V,4.3A;阈值电压(Vgs(th)@Id):1.3V@250uA;; LCSC Part Name: 1个P沟道 耐压:30V 电流:4A; Supplier Part: C15127; Manufacturer: AOS; Supplier Footprint: SOT-23; JLCPCB Part Class: 基础库; Datasheet: https://atta.szlcsc.com/upload/public/pdf/source/20160507/1462613609053.pdf; Supplier: LCSC; Type: 1个P沟道; Drain Source Voltage (Vdss): 30V; Continuous Drain Current (Id): 4A; Power Dissipation (Pd): 1.4W; Drain Source On Resistance (RDS(on)@Vgs,Id): 44mΩ@10V,4.3A; Gate Threshold Voltage (Vgs(th)@Id): 1.3V@250uA; Total Gate Charge (Qg@Vgs): 12.2nC@4.5V; Input Capacitance (Ciss@Vds): 1.2nF@15V; Operating Temperature: -55℃~+150℃@(Tj)
U8 = STC32F12K54-64I-LQFP48: Supplier Part: C7430197; Manufacturer: STC(宏晶); Supplier Footprint: LQFP-48(7x7); JLCPCB Part Class: 扩展库; Datasheet: https://atta.szlcsc.com/upload/public/pdf/source/20230914/EE84BFAB73746799BFCD977324263BA5.pdf; Supplier: LCSC
U9 = CH340E: 应用功能:收发器;接口协议:USB 2.0;数据速率:2Mbps;; LCSC Part Name: USB转串口芯片 CH340; Supplier Part: C99652; Manufacturer: WCH(南京沁恒); Supplier Footprint: MSOP-10; JLCPCB Part Class: 扩展库; Datasheet: https://atta.szlcsc.com/upload/public/pdf/source/20230530/6E401E9554E9F5311886CC8B3F89B62E.pdf; Supplier: LCSC; Applications Function: 收发器; Protocol: USB 2.0; Supply Voltage: 3.3V；5V; Data Rate: 2Mbps
USB1 = TYPEC-304J-BCP16: 连接器类型:Type-C;标准:USB 3.1;公母:母;端口数量:1;触点数量:16P;安装方式:卧贴;额定电流 - 电源:5A;工作温度范围:-40℃~+85℃;焊接温度(最大值):260℃;; LCSC Part Name: Type-C 母 卧贴; Supplier Part: C2835315; Manufacturer: XUNPU(讯普); Supplier Footprint: SMD; JLCPCB Part Class: 扩展库; Datasheet: https://atta.szlcsc.com/upload/public/pdf/source/20210528/C2835315_A76BD3CF9329D12B6041421AD23BFD66.pdf; Supplier: LCSC; Connector Type: Type-C; Standard: USB 3.1; Gender: 母; Number of Ports: 1; Number of Contacts: 16P; Mounting Style: 卧贴; Current Rating - Power (Max): 5A; Operating Temperature Range: -40℃~+85℃; Soldering Temperature(Max): 260℃

## Nets
3V3: C13.2 C36.1 C37.2 C40.2 C41.2 CN6.1 H1.2 J1.2 J2.2 L4.1 R18.1 R23.1 R41.1 U3.14(VCC) U7.5(OUT) U8.15(VCC/AVCC)
5V0: C22.1 C23.2 C34.1 C35.2 C46.1 C47.2 C51.2 C52.2 CN5.1 D6.1(K) H3.7 L2.2 LED5.1(VDD) LED6.1(VDD) U5.1(IN) U5.3(EN) U7.1(IN) U7.3(EN)
7V4: C16.2 C17.2 C18.2 H2.2 L1.2 R8.2 R11.1
+5V: C29.2 C30.2 C31.2 D2.2(A) L5.2 R19.1
DGND: C13.1 C22.2 C23.1 C34.2 C35.1 C36.2 C37.1 C39.2 C40.1 C41.1 C42.1 C43.1 C44.1 C45.1 C46.2 C47.1 C51.1 C52.1 CN4.3 CN4.4 CN4.5 CN5.3 CN5.4 CN5.5 CN6.2 CN6.7 CN6.8 D3.2(A) H1.1 H3.5 H3.6 J1.1 J2.1 LED3.1(C) LED5.3(GND) LED6.3(GND) LED7.1(C) Q10.2(E) R3.2 R4.2 R5.2 R6.2 R13.1 R21.2 R25.1 R26.1 R27.1 R43.2 SW3.2 SW5.1(PIN1) SW5.2(PIN2) SW5.3(PIN3) SW6.4(COMMON) SW7.2 SW8.2 U3.1(1OE#) U3.4(2OE#) U3.7(GND) U3.10(3OE#) U3.13(4OE#) U5.2(GND) U7.2(GND) U8.17(GND/AGND/VREF-) U9.3(GND) USB1.13(GND) USB1.14(GND) USB1.15(GND) USB1.16(GND) USB1.A1B12(GND) USB1.B1A12(GND)
GNDCAM: C24.2 C25.1 C48.2 C49.2 FPC1.3 FPC1.6 FPC2.3 FPC2.6 LED8.1(C) R13.2
PGND: C4.1 C5.1 C6.1 C7.1 C9.2 C10.2 C11.1 C12.1 C14.2 C16.1 C17.1 C18.1 C19.1 C20.1 C21.2 C26.1 C27.2 C29.1 C30.1 C31.1 C32.1 C33.2 C38.2 CN3.1(-) D1.2(A) D4.1(K) H2.3 LED1.1(C) LED2.1(C) LED4.1(C) Q5.3(S) Q6.3(S) Q7.3(S) Q8.3(S) R9.2 R12.1 R17.2 R20.1 R21.1 SW1.4 SW1.5 SW2.1 SW2.4 SW2.5 U1.5(GND) U1.16(GND) U1.20(SN) U1.21(SP) U1.25(EP) U2.5(GND) U2.16(GND) U2.20(SN) U2.21(SP) U2.25(EP) U4.1(GND) U4.5(LPM) U6.1(GND) U6.5(LPM)
VBAT: C2.2 C3.2 C4.2 C5.2 C6.2 C7.2 C19.2 C20.2 C26.2 C32.2 C38.1 CN3.2(+) D4.2(A) Q1.1(D) Q2.1(D) Q3.1(D) Q4.1(D) R1.1 R15.1 R22.2 U1.1(VM) U2.1(VM) U4.3(IN) U4.15(EP) U6.3(IN) U6.15(EP)
BUZZER: R42.1 R43.1 U8.21(P3.2/INT0/SCLK_4/SCL_4/PWMETI/PWMETI2/I2SCK)
CCD_AO1: FPC1.4 U8.46(P0.3/AD3/ADC11/TXD4/PWM8_3/T4CLKO_2/CAN2_TX/LIN_TX)
CCD_AO2: FPC2.4 U8.2(P0.5/AD5/ADC13/T3CLKO)
CCD_CLK: FPC1.2 FPC2.2 U8.4(P0.7/AD7/T4CLKO)
CCD_SI: FPC1.1 FPC2.1 U8.45(P0.2/AD2/ADC10/RXD4/PWM7_3/T4_2/CAN2_RX/LIN_RX)
DIR1: U1.15(PH) U3.11(4Y)
DIR2: U2.15(PH) U3.3(1Y)
DSW_1: R30.1 U8.3(P0.6/AD6/ADC14/T4/PWMFLT2_2)
DSW_2: R28.1 U8.6(P1.1/ADC1/PWM1N/TXD2)
DSW_3: R29.1 U8.9(P1.5/ADC5/PWM3N/SCLK/S1SCLK/S2SCLK/SCL/I2SCK_2)
EN: R15.2 SW2.2 U4.4(EN) U6.4(EN)
ENC1_DIR: J1.4 U8.26(P3.5/T1/T0CLKO/SS_4/PWMFLT/I2SWS)
ENC1_LSB: J1.3 U8.23(P3.4/T0/T1CLKO/MOSI_4/PWM4P_4/PWM8_2/CMPO/I2SSD)
ENC2_DIR: J2.4 U8.1(P5.3/TXD4_2/CAN2_TX_2/LIN_TX_2)
ENC2_LSB: J2.3 U8.47(P0.4/AD4/ADC12/T3)
ESC1_PWM2N: R31.1 U8.12(P1.3/ADC3/MOSI/S1MOSI/S2MOSI/PWM2N/T2CLKO/I2SSD_2)
ESC2_PWM1: R32.1 U8.5(P1.0/ADC0/PWM1P/RXD2)
IMU_CS: CN6.6 U8.31(P4.3/RXD_4/SCLK_3/S1SCLK_3/S2SCLK_3/I2SCK_4)
IMU_MISO: CN6.5 U8.30(P4.2/WR/CAN_RX_3)
IMU_MOSI: CN6.4 U8.29(P4.1/MISO_3/S1MISO_3/S2MISO_3/CMPO_2/PWMETI_3)
IMU_SCK: CN6.3 U8.18(P4.0/MOSI_3/S1MOSI_3/S2MOSI_3/I2SSD_4)
IR_AD: CN5.2 U8.8(P1.4/ADC4/PWM3P/MISO/S1MISO/S2MISO/SDA)
ISP_RX: D5.2 U8.19(P3.0/D-/RXD/INT4)
ISP_TX: R24.2 U8.20(P3.1/D+/TXD)
KEY1: R38.1 U8.48(P5.2/RXD4_2/CAN2_RX_2/LIN_RX_2)
KEY2: R39.1 U8.10(P1.6/ADC6/RXD_3/PWM4P/MCLKO_2/XTALO/I2SMCK_2/I2SMCK_4)
LCD_BLK: H1.8 U8.40(P2.7/A15/PWM4N_2)
LCD_CS: H1.7 U8.35(P2.2/A10/SS_2/S1SS_2/S2SS_2/PWM2P_2/PWM7/I2SWS_3)
LCD_DC: H1.6 U8.34(P2.1/A9/PWM1N_2/PWM6)
LCD_MOSI: H1.4 U8.36(P2.3/A11/MOSI_2/S1MOSI_2/S2MOSI_2/PWM2N_2/PWM8/I2SSD_3)
LCD_RES: H1.5 U8.33(P2.0/A8/PWM1P_2/PWM5)
LCD_SCK: H1.3 U8.38(P2.5/A13/SCLK_2/S1SCLK_2/S2SCLK_2/SCL_2/PWM3N_2/I2SCK_3)
MOTOR1_DIR: R4.1 U3.12(4A) U8.37(P2.4/A12/MISO_2/S1MISO_2/S2MISO_2/SDA_2/PWM3P_2)
MOTOR1_PWM: R6.1 U3.9(3A) U8.44(P0.1/AD1/ADC9/TXD3/PWM6_3/T3CLKO_2/CAN_TX)
MOTOR1A: CN1.2 Q1.3(S) Q5.1(D) U1.23(SH2)
MOTOR1B: CN1.1 Q2.3(S) Q6.1(D) U1.18(SH1)
MOTOR2_DIR: R3.1 U3.2(1A) U8.39(P2.6/A14/PWM4P_2)
MOTOR2_PWM: R5.1 U3.5(2A) U8.43(P0.0/AD0/ADC8/RXD3/PWM5_3/T3_2/CAN_RX)
MOTOR2A: CN2.2 Q3.3(S) Q7.1(D) U2.23(SH2)
MOTOR2B: CN2.1 Q4.3(S) Q8.1(D) U2.18(SH1)
NSLEEP: R2.2 SW1.1 U1.13(nSLEEP) U2.13(nSLEEP)
PWM1: U1.14(EN) U3.8(3Y)
PWM2: U2.14(EN) U3.6(2Y)
RGB: LED6.4(DIN) U8.11(P1.7/ADC7/TXD_3/PWM4N/PWM5_2/XTAL1)
ROCKER_1: R37.2 U8.28(P3.7/INT3/TXD_2/CMP+)
ROCKER_2: R35.1 U8.27(P3.6/INT2/RXD_2/CMP-)
ROCKER_3: R33.1 U8.32(P4.4/RD/TXD_4)
ROCKER_4: R34.2 U8.24(P5.0/RXD3_2/CMP+_2/CAN_RX_2)
ROCKER_5: R36.2 U8.25(P5.1/TXD3_2/CMP+_3/CAN_TX_2)
RST: C44.2 R23.2 SW3.1 U8.14(P5.4/RST/MCLKO/SS_3/S1SS_3/S1SS/S2SS_3/S2SS/PWM2P/PWM6_2/T2/ADC2/I2SWS_2/I2SWS_4/I2SMCK/I2SMCK_3)
SERVO_PWM7: R40.1 U8.22(P3.3/INT1/MISO_4/SDA_4/PWM4N_4/PWM7_2)
SW1: C15.2 L1.1 U4.2(SW) U4.11(SW)
SW2: C28.2 L5.1 U6.2(SW) U6.11(SW)
USB_DN: U9.2(UD-) USB1.A7(DN1) USB1.B7(DN2)
USB_DP: U9.1(UD+) USB1.A6(DP1) USB1.B6(DP2)
VCAM: C24.1 C25.2 C48.1 C49.1 FPC1.7 FPC1.8 FPC2.7 FPC2.8 R10.1 U5.5(OUT)
VREF: C43.2 L4.2 U8.16(VREF+)
VUSB: C45.2 Q9.2(S) SW4.1 U9.7(VCC) USB1.A4B9(VBUS) USB1.B4A9(VBUS)
WUART_RTS: H3.4 U8.41(P4.5/ALE/CAN_TX_3)
WUART_RX: H3.3 U8.42(P4.6/RXD2_2/CAN2_RX_3/LIN_RX_3)
WUART_TX: H3.1 U8.7(P4.7/TXD2_2/CAN2_TX_3/LIN_TX_3)
$1N1035: C3.1 U2.2(VCP)
$1N1036: C8.1 U2.3(CPH)
$1N1037: C8.2 U2.4(CPL)
$1N1045: Q3.2(G) U2.24(GH2)
$1N1046: Q7.2(G) U2.22(GL2)
$1N1047: Q8.2(G) U2.19(GL1)
$1N1058: C12.2 U2.8(DVDD)
$1N1060: C10.1 U2.6(VREF) U2.7(AVDD) U2.12(IDRIVE)
$1N1533: C2.1 U1.2(VCP)
$1N1534: C1.1 U1.3(CPH)
$1N1535: C1.2 U1.4(CPL)
$1N1544: Q1.2(G) U1.24(GH2)
$1N1545: Q5.2(G) U1.22(GL2)
$1N1546: Q6.2(G) U1.19(GL1)
$1N1547: Q2.2(G) U1.17(GH1)
$1N1555: C11.2 U1.8(DVDD)
$1N1557: C9.1 U1.6(VREF) U1.7(AVDD) U1.12(IDRIVE)
$1N1657: Q4.2(G) U2.17(GH1)
$1N4445: LED1.2(A) R2.1
$1N7869: D1.1(K) R1.2 SW1.2
$2N1932: C21.1 U4.7(SS)
$2N1933: R9.1 U4.8(FREQ/SYNC)
$2N1934: C14.1 U4.9(VCC)
$2N1935: R7.1 U4.10(BST)
$2N1936: C15.1 R7.2
$2N1937: R11.2 R12.2 U4.6(FB)
$2N1946: C33.1 U6.7(SS)
$2N1947: R17.1 U6.8(FREQ/SYNC)
$2N1948: C27.1 U6.9(VCC)
$2N1949: R14.1 U6.10(BST)
$2N1950: C28.1 R14.2
$2N1965: LED2.2(A) R8.1
$2N1976: R19.2 R20.2 U6.6(FB)
$2N2691: LED4.2(A) R22.1
$2N3800: LED8.2(A) R10.2
$2N3807: LED7.2(A) R18.2
$2N4471: LED3.2(A) R16.1
$2N6696: D2.1(K) D3.1(C) L2.1 R16.2
$3N1443: D5.1 U9.8(TXD)
$3N1475: R24.1 U9.9(RXD)
$3N1515: C42.2 U9.10(V3)
$3N1777: D6.2(A) Q9.3(D)
$3N1950: Q9.1(G) R25.2 SW4.2
$3N2522: R26.2 USB1.A5(CC1)
$3N2561: R27.2 USB1.B5(CC2)
$3N3175: C39.1 U8.13(UCAP)
$4N185: R28.2 SW5.5(PIN5)
$4N348: R34.1 SW6.6(CENTER)
$4N355: R36.1 SW6.5(D)
$4N359: R37.1 SW6.3(C)
$4N363: R35.2 SW6.2(B)
$4N367: R33.2 SW6.1(A)
$4N672: R38.2 SW7.1
$4N674: R39.2 SW8.1
$4N2083: LED5.4(DIN) LED6.2(DOU)
$4N2405: H2.1 R40.2
$4N2873: B1.1(+) R41.2
$4N2874: Q10.1(B) R42.2
$4N2875: B1.2(-) Q10.3(C)
$4N3117: CN4.1 R31.2
$4N3149: CN4.2 R32.2
$4N5550: R29.2 SW5.4(PIN4)
$4N5579: R30.2 SW5.6(PIN6)

Not connected (* = marked no-connect by the designer): FPC1 5 9 10; FPC2 5 9 10; H3 2 8; J1 5 6; J2 5 6; LED5 2(DOU); SCREW1 1; SCREW2 1; SCREW3 1; SCREW4 1; SCREW5 1; SCREW6 1; SW1 3*; SW2 3*; U1 9(nFAULT)* 10(SNSOUT)* 11(SO)*; U2 9(nFAULT)* 10(SNSOUT)* 11(SO)*; U5 4(NC); U7 4(NC); U9 4(RTS#)* 5(CTS#)* 6(TNOW)*; USB1 A8(SBU1)* B8(SBU2)*

## Notes on the sheets
sheet 1
- 缓冲电路
- 使能开关
- 电机输出
- 下拉稳定三态缓冲器状态
sheet 2
- 电源输入
- 使能开关
- CCD电源
- 8.4V舵机电源
  理论反馈电阻
  260K 28K
- 3.3V电源
- 5V电源
  反馈电阻
  374 48.7
  590 78.7
sheet 3
- 基准电压
- 软件复位
- 下载电路
- 硬件复位
sheet 4
- 拨码开关
- 无线串口
- 按键
- CCDCCD
- 定位孔
- 蜂鸣器
- 舵机
- 编码器
- 红外测距
- 姿态传感器
- 电调
- RGB
- 屏幕
